# EAGLE board axiom_beta_interface_dummy_v0.13_r1.3 (EAGLE 7.7.0), part 1 of 2
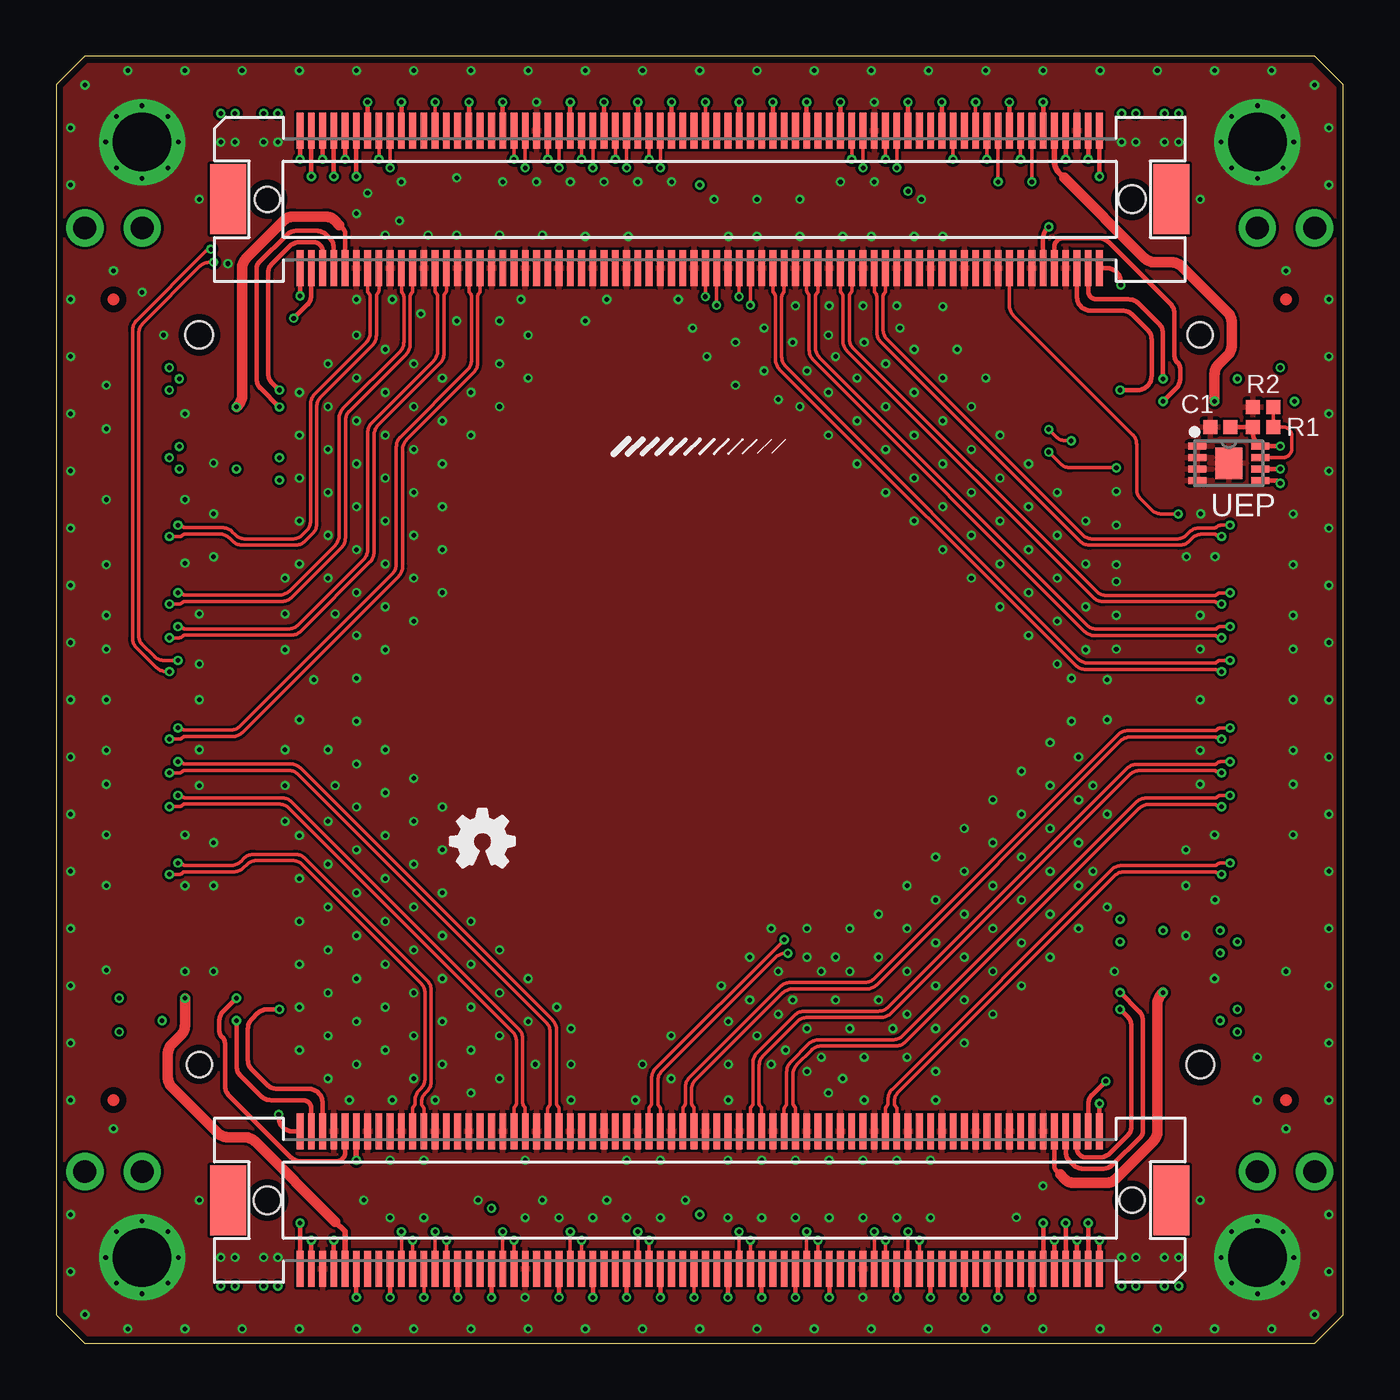
[diagram p3: board, top side]
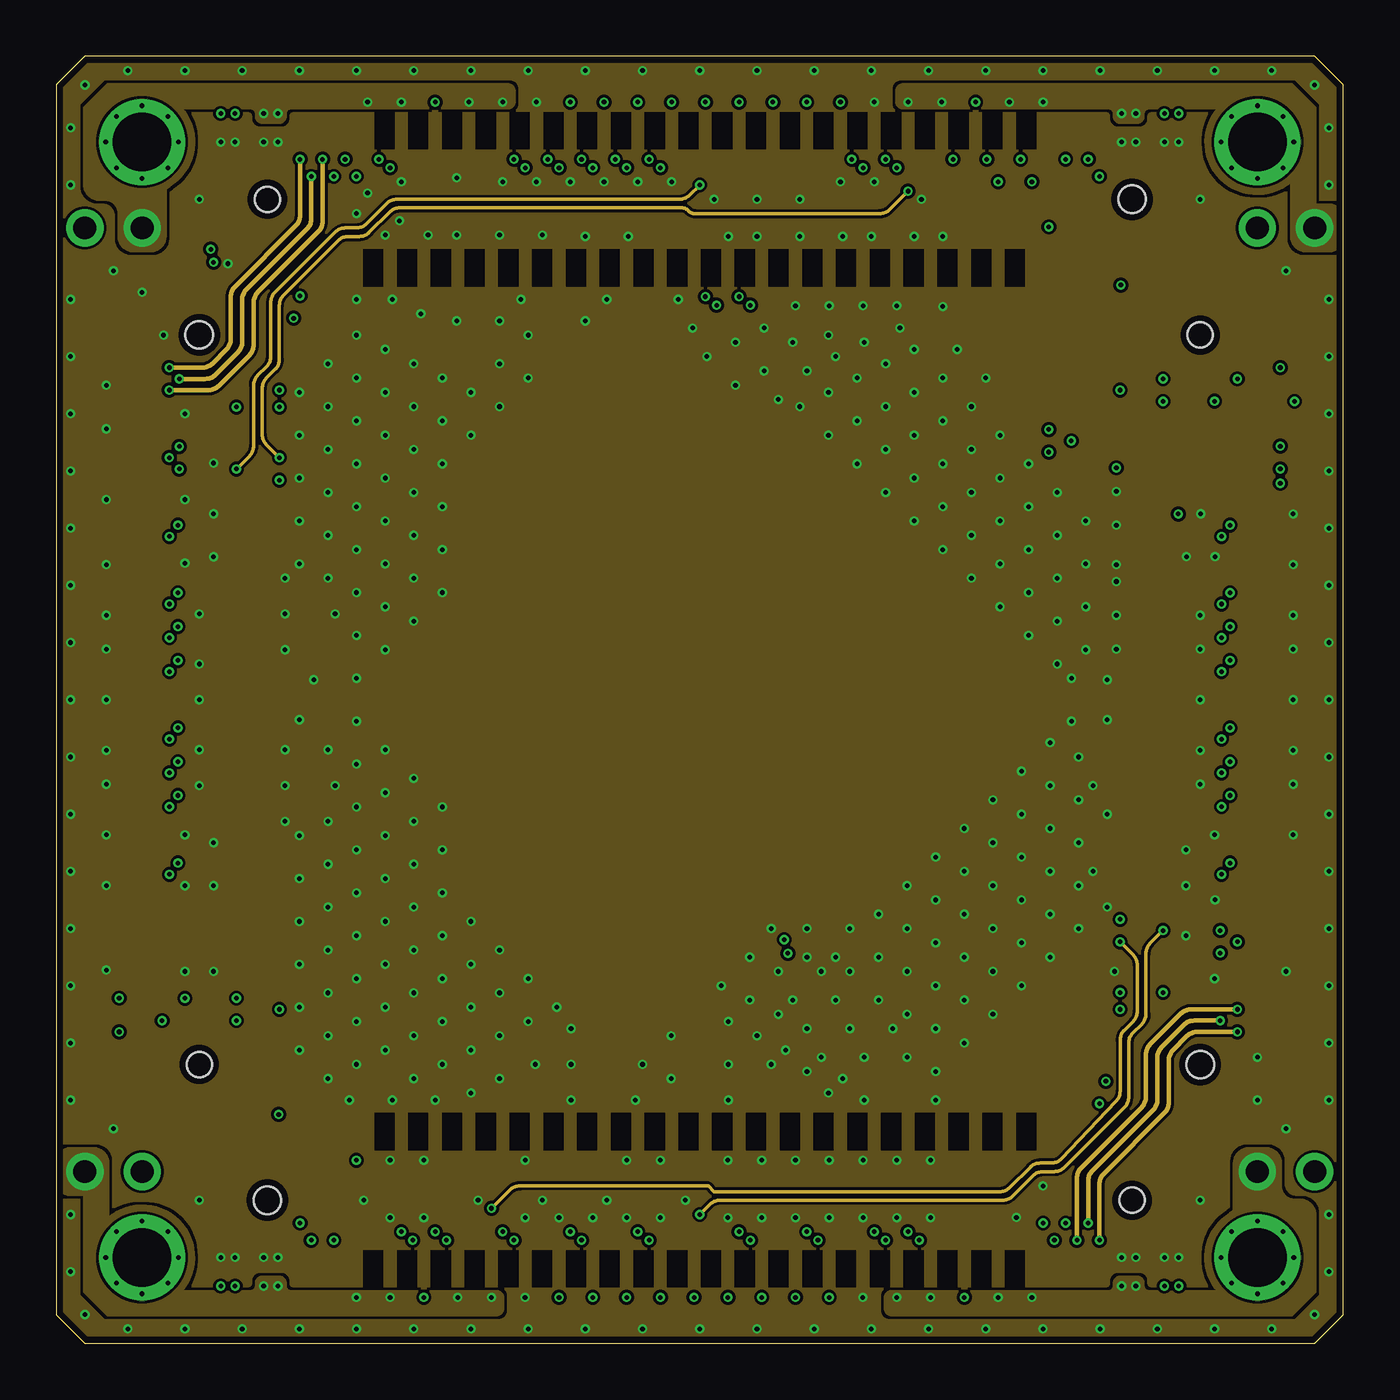
[diagram p4: board, inner layer Route2]
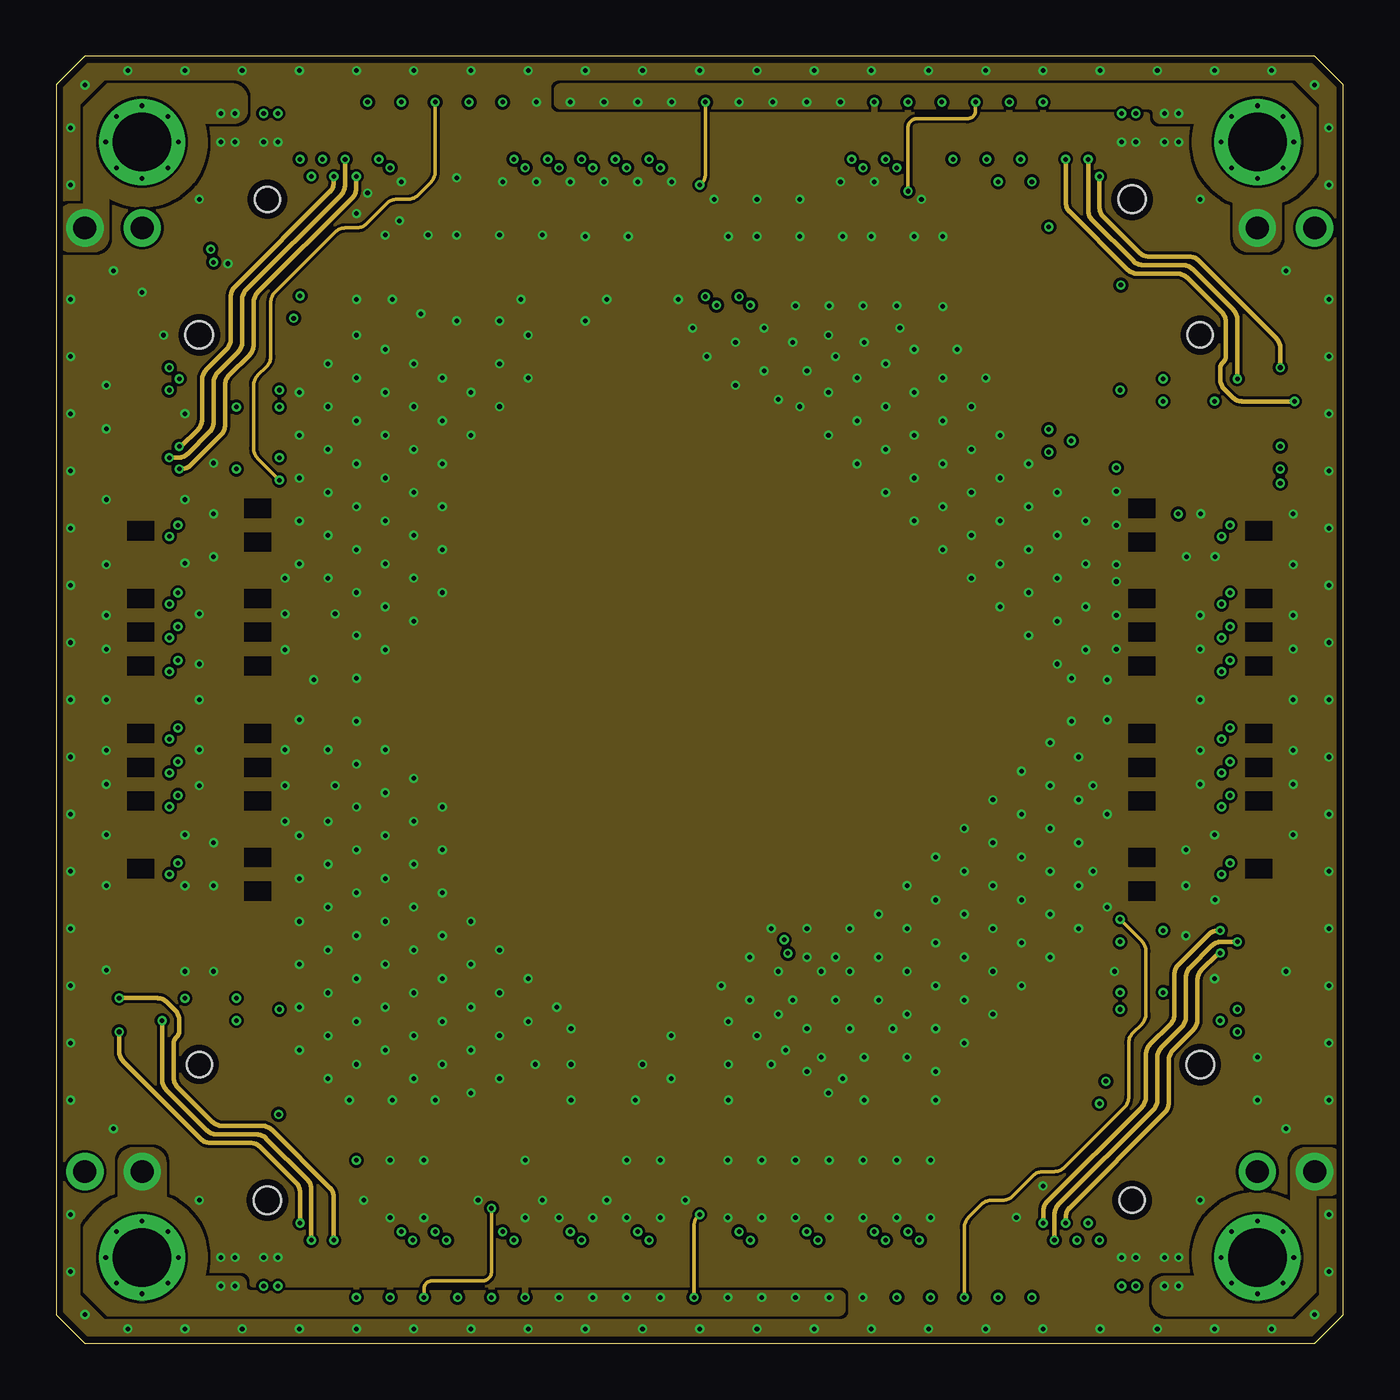
[diagram p5: board, inner layer Route15]
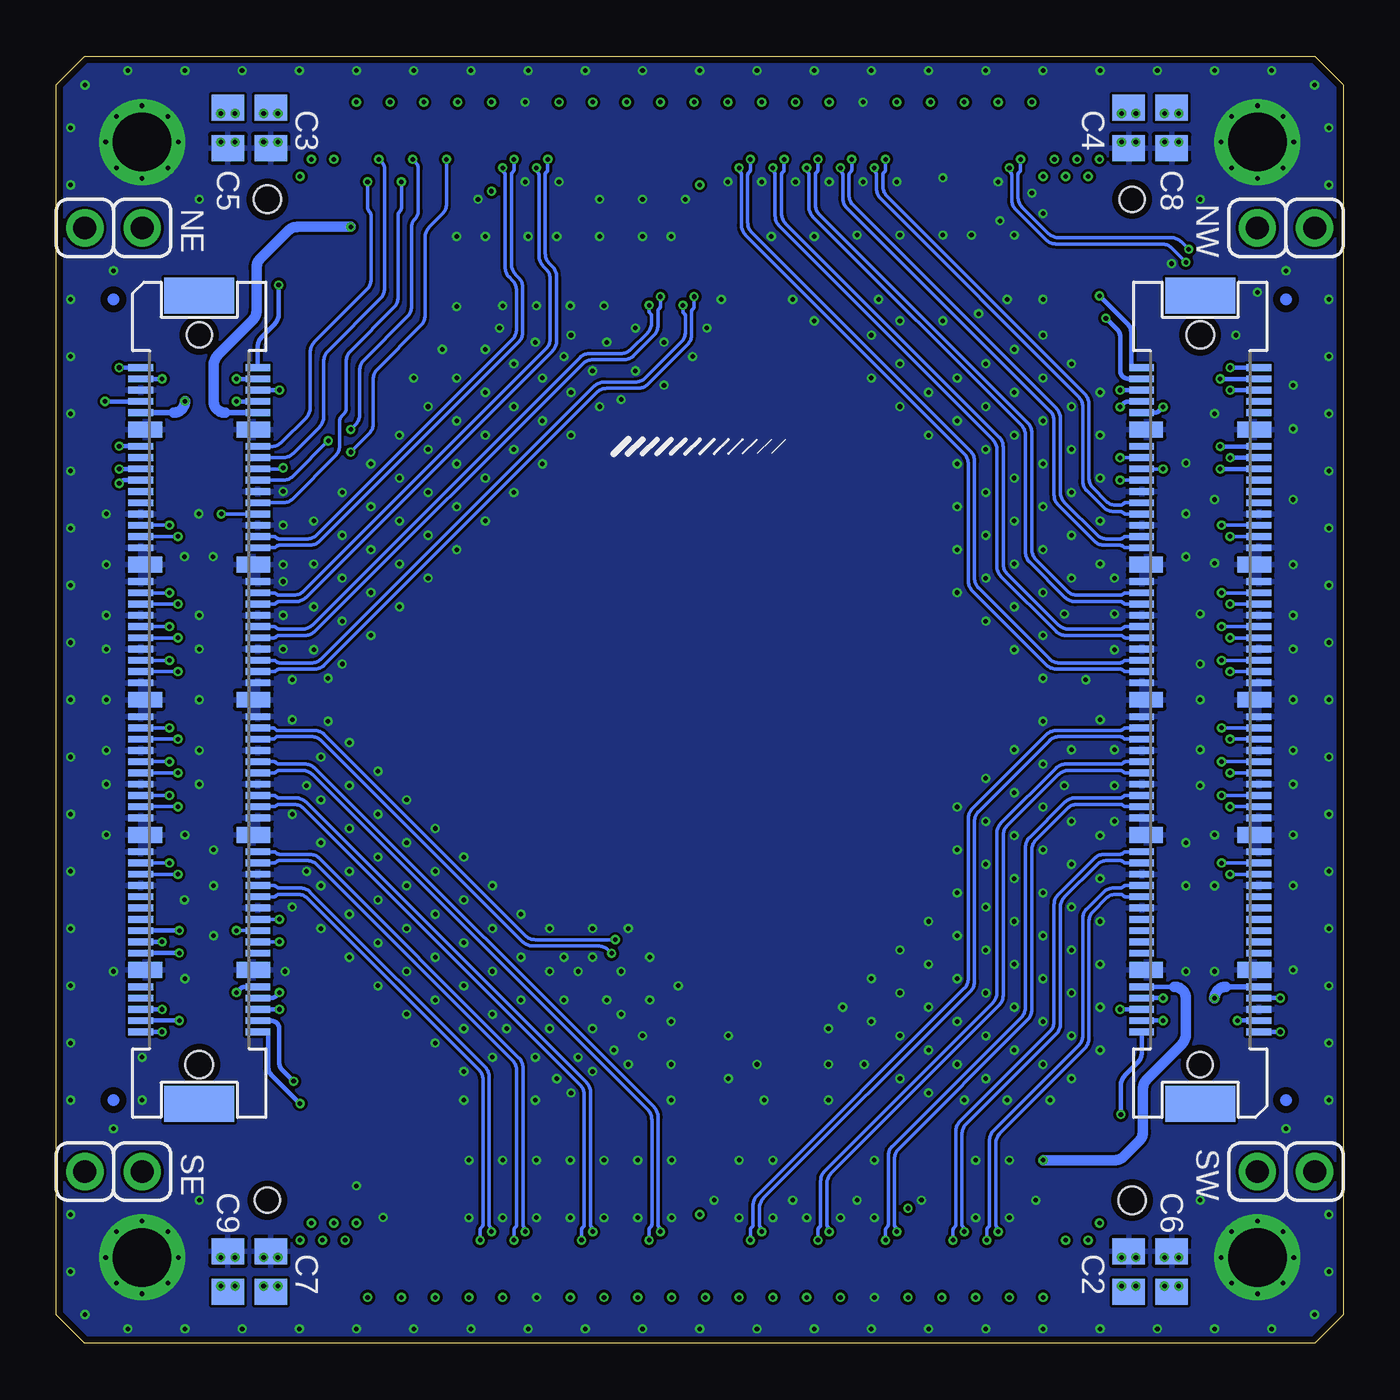
[diagram p6: board, bottom side, seen from below]

Size 57.15 x 57.15 mm. Coordinates in mm from the lower left corner, seen from the top.
Outline: 0,55.88 0,1.27 1.27,0 55.88,0 57.15,1.27 57.15,55.88 55.88,57.15 1.27,57.15 0,55.88
Copper layers (1*2*15*16): Top 0.035559375mm / dielectric 0.17018125mm / Route2 0.01778125mm / dielectric 47mil / Route15 0.01778125mm / dielectric 0.17018125mm / Bottom 0.035559375mm
Design rules "OSHPark-4layer-tuned *": minimum track width 5mil, minimum drill 8mil, track to track 5mil, track to pad 5mil, pad to pad 5mil, via to via 5mil, smd to smd 5mil, copper to edge 12mil, drill to drill 6mil, minimum pad ring 4mil, minimum via ring 4mil, stop-mask expansion 2mil, vias tented up to drill 15mil, thermal gap 6mil
Net classes: 0 default: width 0.152 mm, drill 0.203 mm; 1 power: width 0.152 mm, drill 0.203 mm
tKeepout: area 1.6,51.1 to 6,55.5; area 51.1,51.1 to 55.5,55.5; area 51.1,1.6 to 55.5,6; area 1.6,1.6 to 6,6
bKeepout: area 1.6,51.1 to 6,55.5; area 51.1,51.1 to 55.5,55.5; area 51.1,1.6 to 55.5,6; area 1.6,1.6 to 6,6

## Footprints (pad centres in the part's own frame; a part is rotated, then mirrored left to right if it is on the bottom)
0402-B = smd 0.62 x 0.62: 1 -0.45,0; 2 0.45,0
0805-B = smd 1.15 x 1.45: 1 -0.9,0; 2 0.9,0
1X02 = drill 1.016 pad 1.651: 1 -1.27,0; 2 1.27,0
DFN200X300X100-9N = smd 0.813 x 0.305: 1 -1.397,0.762; 2 -1.397,0.254; 3 -1.397,-0.254; 4 -1.397,-0.762; 5 1.397,-0.762; 6 1.397,-0.254; 7 1.397,0.254; 8 1.397,0.762 | smd 1.194 x 1.397: EP 0,0
FX10A-100P/10 = smd 0.3 x 1.1: 1 -14.75,-2.6; 2 -14.75,2.6; 3 -14.25,-2.6; 4 -14.25,2.6; 5 -13.75,-2.6; 6 -13.75,2.6; 7 -13.25,-2.6; 8 -13.25,2.6; 9 -12.75,-2.6; 10 -12.75,2.6; 11 -11.25,-2.6; 12 -11.25,2.6; 13 -10.75,-2.6; 14 -10.75,2.6; 15 -10.25,-2.6; 16 -10.25,2.6; 17 -9.75,-2.6; 18 -9.75,2.6; 19 -9.25,-2.6; 20 -9.25,2.6; 21 -8.75,-2.6; 22 -8.75,2.6; 23 -8.25,-2.6; 24 -8.25,2.6; 25 -7.75,-2.6; 26 -7.75,2.6; 27 -7.25,-2.6; 28 -7.25,2.6; 29 -6.75,-2.6; 30 -6.75,2.6; 31 -5.25,-2.6; 32 -5.25,2.6; 33 -4.75,-2.6; 34 -4.75,2.6; 35 -4.25,-2.6; 36 -4.25,2.6; 37 -3.75,-2.6; 38 -3.75,2.6; 39 -3.25,-2.6; 40 -3.25,2.6; 41 -2.75,-2.6; 42 -2.75,2.6; 43 -2.25,-2.6; 44 -2.25,2.6; 45 -1.75,-2.6; 46 -1.75,2.6; 47 -1.25,-2.6; 48 -1.25,2.6; 49 -0.75,-2.6; 50 -0.75,2.6; 51 0.75,-2.6; 52 0.75,2.6; 53 1.25,-2.6; 54 1.25,2.6; 55 1.75,-2.6; 56 1.75,2.6; 57 2.25,-2.6; 58 2.25,2.6; 59 2.75,-2.6; 60 2.75,2.6; 61 3.25,-2.6; 62 3.25,2.6; 63 3.75,-2.6; 64 3.75,2.6; 65 4.25,-2.6; 66 4.25,2.6; 67 4.75,-2.6; 68 4.75,2.6; 69 5.25,-2.6; 70 5.25,2.6; 71 6.75,-2.6; 72 6.75,2.6; 73 7.25,-2.6; 74 7.25,2.6; 75 7.75,-2.6; 76 7.75,2.6; 77 8.25,-2.6; 78 8.25,2.6; 79 8.75,-2.6; 80 8.75,2.6; 81 9.25,-2.6; 82 9.25,2.6; 83 9.75,-2.6; 84 9.75,2.6; 85 10.25,-2.6; 86 10.25,2.6; 87 10.75,-2.6; 88 10.75,2.6; 89 11.25,-2.6; 90 11.25,2.6; 91 12.75,-2.6; 92 12.75,2.6; 93 13.25,-2.6; 94 13.25,2.6; 95 13.75,-2.6; 96 13.75,2.6; 97 14.25,-2.6; 98 14.25,2.6; 99 14.75,-2.6; 100 14.75,2.6 | smd 0.7 x 1.5: G1 -12,-2.4; G2 -12,2.4; G3 -6,-2.4; G4 -6,2.4; G5 0,-2.4; G6 0,2.4; G7 6,-2.4; G8 6,2.4; G9 12,-2.4; G10 12,2.4 | smd 1.6 x 3.1: M1 -17.95,0; M2 17.95,0 | hole 1.125: -16.2,0 | hole 1.225: 16.2,0
FX10A-144S = smd 0.3 x 1.6: 1 -17.75,3.05; 2 -17.75,-3.05; 3 -17.25,3.05; 4 -17.25,-3.05; 5 -16.75,3.05; 6 -16.75,-3.05; 7 -16.25,3.05; 8 -16.25,-3.05; 9 -15.75,3.05; 10 -15.75,-3.05; 11 -15.25,3.05; 12 -15.25,-3.05; 13 -14.75,3.05; 14 -14.75,-3.05; 15 -14.25,3.05; 16 -14.25,-3.05; 17 -13.75,3.05; 18 -13.75,-3.05; 19 -13.25,3.05; 20 -13.25,-3.05; 21 -12.75,3.05; 22 -12.75,-3.05; 23 -12.25,3.05; 24 -12.25,-3.05; 25 -11.75,3.05; 26 -11.75,-3.05; 27 -11.25,3.05; 28 -11.25,-3.05; 29 -10.75,3.05; 30 -10.75,-3.05; 31 -10.25,3.05; 32 -10.25,-3.05; 33 -9.75,3.05; 34 -9.75,-3.05; 35 -9.25,3.05; 36 -9.25,-3.05; 37 -8.75,3.05; 38 -8.75,-3.05; 39 -8.25,3.05; 40 -8.25,-3.05; 41 -7.75,3.05; 42 -7.75,-3.05; 43 -7.25,3.05; 44 -7.25,-3.05; 45 -6.75,3.05; 46 -6.75,-3.05; 47 -6.25,3.05; 48 -6.25,-3.05; 49 -5.75,3.05; 50 -5.75,-3.05; 51 -5.25,3.05; 52 -5.25,-3.05; 53 -4.75,3.05; 54 -4.75,-3.05; 55 -4.25,3.05; 56 -4.25,-3.05; 57 -3.75,3.05; 58 -3.75,-3.05; 59 -3.25,3.05; 60 -3.25,-3.05; 61 -2.75,3.05; 62 -2.75,-3.05; 63 -2.25,3.05; 64 -2.25,-3.05; 65 -1.75,3.05; 66 -1.75,-3.05; 67 -1.25,3.05; 68 -1.25,-3.05; 69 -0.75,3.05; 70 -0.75,-3.05; 71 -0.25,3.05; 72 -0.25,-3.05; 73 0.25,3.05; 74 0.25,-3.05; 75 0.75,3.05; 76 0.75,-3.05; 77 1.25,3.05; 78 1.25,-3.05; 79 1.75,3.05; 80 1.75,-3.05; 81 2.25,3.05; 82 2.25,-3.05; 83 2.75,3.05; 84 2.75,-3.05; 85 3.25,3.05; 86 3.25,-3.05; 87 3.75,3.05; 88 3.75,-3.05; 89 4.25,3.05; 90 4.25,-3.05; 91 4.75,3.05; 92 4.75,-3.05; 93 5.25,3.05; 94 5.25,-3.05; 95 5.75,3.05; 96 5.75,-3.05; 97 6.25,3.05; 98 6.25,-3.05; 99 6.75,3.05; 100 6.75,-3.05; 101 7.25,3.05; 102 7.25,-3.05; 103 7.75,3.05; 104 7.75,-3.05; 105 8.25,3.05; 106 8.25,-3.05; 107 8.75,3.05; 108 8.75,-3.05; 109 9.25,3.05; 110 9.25,-3.05; 111 9.75,3.05; 112 9.75,-3.05; 113 10.25,3.05; 114 10.25,-3.05; 115 10.75,3.05; 116 10.75,-3.05; 117 11.25,3.05; 118 11.25,-3.05; 119 11.75,3.05; 120 11.75,-3.05; 121 12.25,3.05; 122 12.25,-3.05; 123 12.75,3.05; 124 12.75,-3.05; 125 13.25,3.05; 126 13.25,-3.05; 127 13.75,3.05; 128 13.75,-3.05; 129 14.25,3.05; 130 14.25,-3.05; 131 14.75,3.05; 132 14.75,-3.05; 133 15.25,3.05; 134 15.25,-3.05; 135 15.75,3.05; 136 15.75,-3.05; 137 16.25,3.05; 138 16.25,-3.05; 139 16.75,3.05; 140 16.75,-3.05; 141 17.25,3.05; 142 17.25,-3.05; 143 17.75,3.05; 144 17.75,-3.05 | smd 1.6 x 3.1: M1 -20.95,0; M2 20.95,0 | hole 1.125: -19.2,0 | hole 1.225: 19.2,0

## Placement (x,y rotation side)
C1  100n  [0402-B]  51.69,40.69 180 top
C2  47u  [0805-B]  9.52,3.18 90 bottom
C3  47u  [0805-B]  49.53,53.97 270 bottom
C4  47u  [0805-B]  9.52,53.97 270 bottom
C5  47u  [0805-B]  47.62,53.97 270 bottom
C6  47u  [0805-B]  7.62,3.18 90 bottom
C7  47u  [0805-B]  47.62,3.18 90 bottom
C8  47u  [0805-B]  7.62,53.97 270 bottom
C9  47u  [0805-B]  49.53,3.18 90 bottom
FID1  FIDUCIAL  [FID_ARROW]  2.54,46.36 0 top
FID2  FIDUCIAL  [FID_ARROW]  54.61,46.36 0 top
FID3  FIDUCIAL  [FID_ARROW]  54.61,10.79 0 top
FID4  FIDUCIAL  [FID_ARROW]  2.54,10.79 0 top
FID5  FIDUCIAL-3A  [FID_3ARROW]  2.54,46.36 180 bottom
FID6  FIDUCIAL-3A  [FID_3ARROW]  54.61,46.36 0 bottom
FID7  FIDUCIAL-3A  [FID_3ARROW]  54.61,10.79 0 bottom
FID8  FIDUCIAL-3A  [FID_3ARROW]  2.54,10.79 180 bottom
LOGO1  OSHW_LOGO_FILLX0100-NT  [OSHW_FILLX100_NOTEXT]  17.5,21.16 0 top
NE  [1X02]  54.61,49.53 180 bottom
NW  [1X02]  2.54,49.53 0 bottom
PARALLELLA  [PARALLELLA-FRAME]  28.57,28.57 0 top
R1  10k  [0402-B]  53.59,40.69 0 top
R2  1k  [0402-B]  53.59,41.58 180 top
SE  [1X02]  54.61,7.62 180 bottom
SW  [1X02]  2.54,7.62 0 bottom
U$1  [µZ-FRAME]  28.57,28.57 0 top
U$2  APERTUS_LOGO334X100  [APERTUS_LOGO_334X100]  19.5,30.29 0 top
U$3  AXIOM_LOGO525X80  [AXIOM_LOGO_525X80]  22.02,28.09 0 top
UEP  BR24G04NUX  [DFN200X300X100-9N]  52.07,39.08 0 top
X-EAST  FX10-100/10P  [FX10A-100P/10]  50.8,28.57 270 bottom
X-NORTH  FX10-144S  [FX10A-144S]  28.57,50.8 0 top
X-SOUTH  FX10-144S  [FX10A-144S]  28.57,6.35 180 top
X-WEST  FX10-100/10P  [FX10A-100P/10]  6.35,28.57 90 bottom

## Tracks (layer width: path | path; a pad name or v marks a point on that pad's centre or on a via)
CLK_IN  (via drill 0.2)
  Top 0.152: X-NORTH.128 42.33,46.09 arc45 42.51,45.64 47.79,40.36 arc-45 47.97,39.91 47.97,37.94 arc45 48.16,37.49 48.64,37.01 arc45 49.09,36.83 v49.83,36.83
  Bottom 0.152: X-EAST.24 v49.83,36.83
E_I2C_V  (via drill 0.2)
  Top 0.203: v54.36,39.84 UEP.8 53.33,39.97 arc-45 53.14,40.42 R1.1 C1.1
  Bottom 0.152: X-EAST.11 arc-45 53.43,39.84
  Bottom 0.203: 53.43,39.84 v54.36,39.84
E_SCL  (via drill 0.2)
  Top 0.203: UEP.6 v54.36,38.82
  Bottom 0.203: v54.36,38.82 v54.35,38.83 X-EAST.15
E_SDA  (via drill 0.2)
  Top 0.203: 54.25,38.29 v54.36,38.19 54.23,38.31 UEP.5
  Bottom 0.203: v54.36,38.19 54.29,38.25 arc45 54.11,38.33 X-EAST.17
E_VE  (via drill 0.2)
  Bottom 0.152: v49.85,2.54 49.8,2.54 C9.1
  other vias: 49.21,2.54
  pour Route15 (no thermals): 50.64,2.92 arc-141 54.86,6.21 54.86,8 arc-90 55.5,8.64 56.52,8.64 arc-90 57.15,8 57.15,7.24 arc-90 56.52,6.6 55.88,6.6 55.88,2.29 54.86,1.27 49.35,1.27 arc-90 48.72,1.9 48.72,2.43 arc-90 49.23,2.92
FRAME_REQ  (via drill 0.2)
  Top 0.152: X-NORTH.129 v42.83,52.58
  Bottom 0.152: v42.83,52.58 42.69,52.44 arc45 42.58,52.17 42.58,46.84 arc45 42.76,46.39 45.09,44.06 arc-45 45.27,43.61 45.27,41.14 arc45 45.46,40.69 46.64,39.51 arc45 47.09,39.33 X-EAST.14
GND  (via drill 0.2, 0.2 pad 0.25, 2.6 pad 3.81)
  other vias: 1.27,1.27 0.63,3.18 0.63,5.71 0.63,10.79 0.63,13.33 0.63,15.88 0.63,18.41 0.63,20.95 0.63,23.49 0.63,26.04 0.63,28.57 0.63,31.11 0.63,33.66 0.63,36.2 0.63,38.73 0.63,41.27 0.63,43.81 0.63,46.36 0.63,51.44 0.63,53.97 1.27,55.88 56.52,3.18 56.52,5.71 56.52,10.79 56.52,13.33 56.52,15.88 56.52,18.41 56.52,20.95 56.52,23.49 56.52,26.04 56.52,28.57 56.52,31.11 56.52,33.66 56.52,36.2 56.52,38.73 56.52,41.27 56.52,43.81 56.52,46.36 56.52,51.44 56.52,53.97 55.88,55.88 53.97,56.52 51.44,56.52 48.89,56.52 46.36,56.52 43.81,56.52 41.27,56.52 38.73,56.52 36.2,56.52 33.66,56.52 31.11,56.52 28.57,56.52 26.04,56.52 23.49,56.52 20.95,56.52 18.41,56.52 15.88,56.52 13.33,56.52 10.79,56.52 8.25,56.52 5.71,56.52 3.18,56.52 53.97,0.63 51.44,0.63 48.89,0.63 46.36,0.63 43.81,0.63 41.27,0.63 38.73,0.63 36.2,0.63 33.66,0.63 31.11,0.63 28.57,0.63 26.04,0.63 23.49,0.63 20.95,0.63 18.41,0.63 15.88,0.63 13.33,0.63 10.79,0.63 8.25,0.63 5.71,0.63 3.18,0.63 55.88,1.27 21.32,55.12 36.33,55.12 20.82,2.03 35.82,2.03 47.08,32.33 47.08,33.83 47.08,30.82 47.08,34.58 47.08,36.33 47.08,37.83 35.83,46.08 37.33,46.08 34.33,46.08 32.83,46.08 25.82,51.58 27.32,51.58 24.32,51.58 22.82,51.58 21.32,51.58 19.82,51.58 34.83,51.58 36.33,51.58 23.82,5.57 26.82,5.57 20.82,5.57 22.32,5.57 25.32,5.57 16.32,5.57 14.82,5.57 29.82,5.57 31.32,5.57 32.83,5.57 34.33,5.57 35.83,5.57 37.33,5.57 38.83,5.57 15.32,51.58 13.82,51.08 12.06,15.56 10.79,13.02 13.33,12.38 14.92,10.79 16.83,10.79 15.88,11.75 14.6,13.02 13.33,14.29 12.06,13.65 15.88,13.65 14.6,14.92 15.88,15.56 17.14,16.19 18.41,16.83 19.68,15.56 20.95,14.29 18.41,14.92 17.14,14.29 19.68,13.65 18.41,13.02 17.14,12.38 18.41,11.11 19.68,11.75 21.27,12.38 22.86,12.38 22.86,10.79 22.86,13.97 22.23,14.92 20.95,16.19 19.68,17.46 18.41,18.73 17.14,20 17.14,18.1 15.88,17.46 14.6,16.83 13.33,16.19 10.79,14.92 10.79,16.83 12.06,17.46 13.33,18.1 14.6,18.73 15.88,19.37 15.88,21.27 14.6,20.64 13.33,20 13.33,21.91 14.6,22.54 15.88,23.18 17.14,21.91 17.14,23.81 12.06,21.27 10.79,20.64 12.06,19.37 10.79,18.73 10.79,22.54 12.06,23.18 13.33,23.81 14.6,24.45 15.88,25.08 14.6,26.35 13.33,27.62 10.79,27.69 13.33,25.72 10.16,24.77 10.16,26.35 10.16,23.18 12.06,26.35 12.38,24.77 5.71,20.32 6.98,20.32 6.98,22.23 5.71,22.57 13.33,29.53 11.43,29.46 14.6,30.8 15.88,32.07 17.14,33.34 17.14,35.24 17.14,37.15 17.14,39.05 13.33,31.43 14.6,32.7 15.88,33.97 15.88,35.88 14.6,34.61 13.33,35.24 12.06,35.88 10.79,36.51 14.6,36.51 13.33,37.15 12.06,37.78 10.79,38.42 12.06,39.69 13.33,39.05 14.6,38.42 15.88,37.78 15.88,39.69 14.6,40.32 13.33,40.96 12.06,41.59 10.79,42.23 10.79,40.32 10.16,30.8 10.16,32.38 10.16,33.97 13.33,33.34 12.06,33.97 10.79,34.61 12.38,32.38 18.41,40.32 17.14,40.96 15.88,41.59 14.6,42.23 13.33,42.86 12.06,43.5 13.33,44.77 14.6,44.13 15.88,43.5 17.14,42.86 18.41,42.23 19.68,41.59 20.95,42.86 23.49,45.4 19.68,43.5 20.95,44.77 19.68,45.4 17.78,45.4 16.19,45.72 14.92,46.36 13.33,46.36 20.64,46.36 25.72,10.79 29.84,14.29 31.11,13.65 32.38,13.02 34.92,11.75 34.29,11.11 31.75,12.38 29.84,12.38 33.34,13.97 35.24,13.97 37.15,13.97 35.88,12.7 33.97,12.7 33.34,12.06 35.88,10.79 37.78,12.7 39.05,13.97 37.78,14.6 36.51,15.24 33.97,16.51 34.61,15.24 32.7,15.24 32.07,16.51 30.8,15.24 32.07,14.6 29.53,15.88 30.8,17.14 27.3,13.65 27.3,11.75 29.84,10.79 39.05,12.06 40.32,13.33 40.32,15.24 41.59,14.6 42.86,15.88 44.13,17.14 45.4,18.41 41.59,16.51 42.86,17.78 44.13,19.05 39.05,15.88 37.78,16.51 36.51,17.14 35.24,16.51 40.32,17.14 39.05,17.78 37.78,18.41 36.51,19.05 37.78,20.32 39.05,19.68 40.32,19.05 41.59,18.41 42.86,19.68 41.59,20.32 40.32,20.95 39.05,21.59 45.4,20.32 44.13,20.95 42.86,21.59 41.59,22.23 40.32,22.86 45.4,22.23 44.13,22.86 42.86,23.49 41.59,24.13 42.86,25.4 44.13,24.77 45.4,24.13 46.67,23.49 46.04,24.77 45.4,26.04 44.13,26.67 45.09,27.62 45.09,29.53 46.67,27.69 46.67,29.46 45.72,30.8 45.72,32.7 45.72,34.61 44.45,32.07 43.18,33.34 41.91,34.61 43.18,31.43 41.91,32.7 44.45,30.16 40.64,33.97 40.64,35.88 39.37,35.24 39.37,37.15 38.1,36.51 38.1,38.42 36.83,37.78 36.83,39.69 35.56,39.05 35.56,40.96 34.29,40.32 34.29,42.23 33.02,41.59 33.34,43.18 32.07,41.91 30.16,42.55 28.89,43.81 31.43,43.18 30.16,44.45 31.43,45.09 32.7,44.45 34.61,43.81 35.56,42.86 36.83,43.5 38.1,44.13 35.88,44.45 37.47,45.09 34.29,44.77 36.83,41.59 38.1,40.32 39.37,39.05 40.64,37.78 41.91,36.51 43.18,35.24 44.45,33.97 44.45,35.88 45.72,36.51 43.18,37.15 44.45,37.78 41.91,38.42 43.18,39.05 41.91,40.32 40.64,39.69 40.64,41.59 39.37,40.96 38.1,42.23 39.37,42.86 50.82,36.83 50.19,34.93 46.67,19.37 46.04,20.95 39.05,10.79 26.04,12.38 33.34,18.41 35.24,18.41 34.61,17.14 28.26,45.09 21.59,49.21 23.49,49.15 25.4,49.15 13.33,50.16 15.24,49.85 7.62,47.94 2.54,47.62 6.35,50.8 3.81,46.67 50.16,20.32 50.16,21.91 5.71,34.64 6.98,34.92 6.98,36.83 5.71,37.47 51.46,34.93 51.46,19.69 51.44,22.57 51.44,16.19 50.16,18.1 5.71,16.51 6.98,16.51 5.71,41.27 6.98,39.09 24.45,46.36 27.62,46.36 31.75,18.41 12.06,11.75 13.02,10.79 14.82,8.13 16.32,8.13 31.32,8.13 32.83,8.13 34.33,8.13 35.83,8.13 37.33,8.13 38.83,8.13 29.82,8.13 20.82,8.13 25.32,8.13 26.82,8.13 29.84,49.15 31.11,49.15 17.78,49.21 14.6,49.21 16.51,49.21 33.02,49.15 36.2,49.15 34.92,49.15 38.1,49.15 39.37,49.15 39.37,46.04 40,44.13 41.27,42.86 42.63,5.59 43.81,6.98 54.61,47.62 50.8,50.8 6.35,6.35 50.8,6.35 2.54,9.52 54.61,9.52 7.3,3.81 7.94,3.81 9.21,3.81 9.84,3.81 47.31,3.81 47.94,3.81 49.21,3.81 49.85,3.81 49.85,53.34 49.21,53.34 47.94,53.34 47.31,53.34 9.84,53.34 9.21,53.34 7.94,53.34 7.3,53.34 2.22,34.58 2.22,32.33 2.22,30.82 2.22,28.57 2.22,26.32 2.22,24.82 2.22,22.57 2.22,20.32 2.22,16.57 54.93,36.83 54.93,34.58 54.93,32.33 54.93,30.82 54.93,28.57 54.93,26.32 54.93,24.82 54.93,22.57 53.34,10.79 53.34,12.7 46.99,16.51 54.61,16.51 17.78,51.75 29.21,50.8 33.02,50.8 27.94,6.35 18.73,6.35 13.65,6.35 31.11,50.8 6.35,28.57 6.35,30.16 6.35,24.77 6.35,26.35 6.35,32.38 50.8,24.82 50.8,26.32 50.8,28.57 50.8,30.82 50.8,32.33 33.34,17.14 19.68,49.21 38.42,50.8 21.59,6.35 24.45,6.35 2.22,40.61 2.22,37.47 2.22,42.55 4.76,44.77 3.81,3.81 4.95,4.95 4.95,2.67 2.67,2.67 2.67,4.95 53.34,3.81 53.34,5.43 54.96,3.81 53.34,2.19 51.72,3.81 54.48,4.95 54.48,2.67 52.2,2.67 52.2,4.95 3.81,53.34 3.81,54.96 5.43,53.34 3.81,51.72 2.19,53.34 4.95,54.48 4.95,52.2 2.67,52.2 2.67,54.48 53.34,53.34 53.34,54.96 54.96,53.34 53.34,51.72 51.72,53.34 54.48,54.48 54.48,52.2 52.2,52.2 52.2,54.48 3.81,5.43 5.43,3.81 3.81,2.19 2.19,3.81
  pour Top (rank 3): 0,1.27 0,55.88 1.27,57.15 55.88,57.15 57.15,55.88 57.15,1.27 55.88,0 1.27,0
  pour Route2 (rank 3): 0,1.27 0,55.88 1.27,57.15 55.88,57.15 57.15,55.88 57.15,1.27 55.88,0 1.27,0
  pour Route15 (rank 3): 0,1.27 0,55.88 1.27,57.15 55.88,57.15 57.15,55.88 57.15,1.27 55.88,0 1.27,0
  pour Bottom (rank 3): 0,1.27 0,55.88 1.27,57.15 55.88,57.15 57.15,55.88 57.15,1.27 55.88,0 1.27,0
LVDS_CLK_N  (via drill 0.2)
  Top 0.152: X-NORTH.14 13.82,46.74 arc45 13.86,46.65 arc-45 13.93,46.47 13.93,44.88 arc-45 13.75,44.43 11.48,42.15 arc45 11.29,41.7 11.29,36.52 arc-45 11.1,36.07 10.94,35.9 arc-45 10.49,35.71 8.4,35.71 arc-45 7.95,35.9 7.82,36.03 arc45 7.37,36.21 5.73,36.21 arc-45 5.62,36.26 5.56,36.33 v5.4,36.33
  Bottom 0.152: v5.4,36.33 X-WEST.75
LVDS_CLK_P  (via drill 0.2)
  Top 0.152: X-NORTH.16 14.32,46.74 arc-45 14.29,46.65 arc45 14.21,46.47 14.21,44.76 arc-45 14.03,44.31 11.76,42.04 arc45 11.57,41.59 11.57,36.4 arc-45 11.38,35.95 11.05,35.62 arc-45 10.61,35.44 8.28,35.44 arc-45 7.83,35.62 7.7,35.75 arc45 7.25,35.94 5.75,35.94 arc45 5.57,35.86 arc-45 5.48,35.83 v5.02,35.83
  Bottom 0.152: v5.02,35.83 X-WEST.73
N$1
  cutout Route15: 52.83,36.5 53.97,36.5 53.97,35.65 52.83,35.65
  cutout Route15: 52.83,33.5 53.97,33.5 53.97,32.65 52.83,32.65
  cutout Route15: 52.83,32 53.97,32 53.97,31.15 52.83,31.15
  cutout Route15: 52.83,30.5 53.97,30.5 53.97,29.65 52.83,29.65
  cutout Route15: 52.83,27.5 53.97,27.5 53.97,26.65 52.83,26.65
  cutout Route15: 52.83,26 53.97,26 53.97,25.15 52.83,25.15
  cutout Route15: 52.83,24.5 53.97,24.5 53.97,23.65 52.83,23.65
  cutout Route15: 52.83,21.5 53.97,21.5 53.97,20.65 52.83,20.65
  cutout Route15: 47.62,22 48.77,22 48.77,21.15 47.62,21.15
  cutout Route15: 47.62,20.5 48.77,20.5 48.77,19.65 47.62,19.65
  cutout Route15: 47.62,24.5 48.77,24.5 48.77,23.65 47.62,23.65
  cutout Route15: 47.62,26 48.77,26 48.77,25.15 47.62,25.15
  cutout Route15: 47.62,27.5 48.77,27.5 48.77,26.65 47.62,26.65
  cutout Route15: 47.62,30.5 48.77,30.5 48.77,29.65 47.62,29.65
  cutout Route15: 47.62,32 48.77,32 48.77,31.15 47.62,31.15
  cutout Route15: 47.62,33.5 48.77,33.5 48.77,32.65 47.62,32.65
  cutout Route15: 47.62,36 48.77,36 48.77,35.15 47.62,35.15
  cutout Route15: 47.62,37.5 48.77,37.5 48.77,36.65 47.62,36.65
  cutout Route15: 9.52,29.65 8.38,29.65 8.38,30.5 9.52,30.5
  cutout Route15: 9.52,31.15 8.38,31.15 8.38,32 9.52,32
  cutout Route15: 9.52,32.65 8.38,32.65 8.38,33.5 9.52,33.5
  cutout Route15: 9.52,35.15 8.38,35.15 8.38,36 9.52,36
  cutout Route15: 9.52,36.65 8.38,36.65 8.38,37.5 9.52,37.5
  cutout Route15: 9.52,26.65 8.38,26.65 8.38,27.5 9.52,27.5
  cutout Route15: 9.52,25.15 8.38,25.15 8.38,26 9.52,26
  cutout Route15: 9.52,23.65 8.38,23.65 8.38,24.5 9.52,24.5
  cutout Route15: 9.52,21.15 8.38,21.15 8.38,22 9.52,22
  cutout Route15: 9.52,19.65 8.38,19.65 8.38,20.5 9.52,20.5
  cutout Route15: 4.32,20.65 3.18,20.65 3.18,21.5 4.32,21.5
  cutout Route15: 4.32,23.65 3.18,23.65 3.18,24.5 4.32,24.5
  cutout Route15: 4.32,25.15 3.18,25.15 3.18,26 4.32,26
  cutout Route15: 4.32,26.65 3.18,26.65 3.18,27.5 4.32,27.5
  cutout Route15: 4.32,29.65 3.18,29.65 3.18,30.5 4.32,30.5
  cutout Route15: 4.32,31.15 3.18,31.15 3.18,32 4.32,32
  cutout Route15: 4.32,32.65 3.18,32.65 3.18,33.5 4.32,33.5
  cutout Route15: 4.32,35.65 3.18,35.65 3.18,36.5 4.32,36.5
  cutout Route2: 38.15,53.02 38.15,54.67 39,54.67 39,53.02
  cutout Route2: 36.65,53.02 36.65,54.67 37.5,54.67 37.5,53.02
  cutout Route2: 35.15,53.02 35.15,54.67 36,54.67 36,53.02
  cutout Route2: 33.65,53.02 33.65,54.67 34.5,54.67 34.5,53.02
  cutout Route2: 32.15,53.02 32.15,54.67 33,54.67 33,53.02
  cutout Route2: 30.65,53.02 30.65,54.67 31.5,54.67 31.5,53.02
  cutout Route2: 29.15,53.02 29.15,54.67 30,54.67 30,53.02
  cutout Route2: 27.65,53.02 27.65,54.67 28.5,54.67 28.5,53.02
  cutout Route2: 26.15,53.02 26.15,54.67 27,54.67 27,53.02
  cutout Route2: 24.65,53.02 24.65,54.67 25.5,54.67 25.5,53.02
  cutout Route2: 23.15,53.02 23.15,54.67 24,54.67 24,53.02
  cutout Route2: 21.65,53.02 21.65,54.67 22.5,54.67 22.5,53.02
  cutout Route2: 20.15,53.02 20.15,54.67 21,54.67 21,53.02
  cutout Route2: 18.65,53.02 18.65,54.67 19.5,54.67 19.5,53.02
  cutout Route2: 17.15,53.02 17.15,54.67 18,54.67 18,53.02
  cutout Route2: 15.65,53.02 15.65,54.67 16.5,54.67 16.5,53.02
  cutout Route2: 14.15,53.02 14.15,54.67 15,54.67 15,53.02
  cutout Route2: 39.65,53.02 39.65,54.67 40.5,54.67 40.5,53.02
  cutout Route2: 41.15,53.02 41.15,54.67 42,54.67 42,53.02
  cutout Route2: 42.65,53.02 42.65,54.67 43.5,54.67 43.5,53.02
  cutout Route2: 40.65,46.92 40.65,48.58 41.5,48.58 41.5,46.92
  cutout Route2: 42.15,46.92 42.15,48.58 43,48.58 43,46.92
  cutout Route2: 39.15,46.92 39.15,48.58 40,48.58 40,46.92
  cutout Route2: 37.65,46.92 37.65,48.58 38.5,48.58 38.5,46.92
  cutout Route2: 36.15,46.92 36.15,48.58 37,48.58 37,46.92
  cutout Route2: 34.65,46.92 34.65,48.58 35.5,48.58 35.5,46.92
  cutout Route2: 33.15,46.92 33.15,48.58 34,48.58 34,46.92
  cutout Route2: 31.65,46.92 31.65,48.58 32.5,48.58 32.5,46.92
  cutout Route2: 30.15,46.92 30.15,48.58 31,48.58 31,46.92
  cutout Route2: 28.65,46.92 28.65,48.58 29.5,48.58 29.5,46.92
  cutout Route2: 27.15,46.92 27.15,48.58 28,48.58 28,46.92
  cutout Route2: 25.65,46.92 25.65,48.58 26.5,48.58 26.5,46.92
  cutout Route2: 24.15,46.92 24.15,48.58 25,48.58 25,46.92
  cutout Route2: 22.65,46.92 22.65,48.58 23.5,48.58 23.5,46.92
  cutout Route2: 21.15,46.92 21.15,48.58 22,48.58 22,46.92
  cutout Route2: 19.65,46.92 19.65,48.58 20.5,48.58 20.5,46.92
  cutout Route2: 18.15,46.92 18.15,48.58 19,48.58 19,46.92
  cutout Route2: 16.65,46.92 16.65,48.58 17.5,48.58 17.5,46.92
  cutout Route2: 15.15,46.92 15.15,48.58 16,48.58 16,46.92
  cutout Route2: 13.65,46.92 13.65,48.58 14.5,48.58 14.5,46.92
N$4
  cutout Route2: 19,4.12 19,2.47 18.15,2.47 18.15,4.12
  cutout Route2: 20.5,4.12 20.5,2.47 19.65,2.47 19.65,4.12
  cutout Route2: 22,4.12 22,2.47 21.15,2.47 21.15,4.12
  cutout Route2: 23.5,4.12 23.5,2.47 22.65,2.47 22.65,4.12
  cutout Route2: 25,4.12 25,2.47 24.15,2.47 24.15,4.12
  cutout Route2: 26.5,4.12 26.5,2.47 25.65,2.47 25.65,4.12
  cutout Route2: 28,4.12 28,2.47 27.15,2.47 27.15,4.12
  cutout Route2: 29.5,4.12 29.5,2.47 28.65,2.47 28.65,4.12
  cutout Route2: 31,4.12 31,2.47 30.15,2.47 30.15,4.12
  cutout Route2: 32.5,4.12 32.5,2.47 31.65,2.47 31.65,4.12
  cutout Route2: 34,4.12 34,2.47 33.15,2.47 33.15,4.12
  cutout Route2: 35.5,4.12 35.5,2.47 34.65,2.47 34.65,4.12
  cutout Route2: 37,4.12 37,2.47 36.15,2.47 36.15,4.12
  cutout Route2: 38.5,4.12 38.5,2.47 37.65,2.47 37.65,4.12
  cutout Route2: 40,4.12 40,2.47 39.15,2.47 39.15,4.12
  cutout Route2: 41.5,4.12 41.5,2.47 40.65,2.47 40.65,4.12
  cutout Route2: 43,4.12 43,2.47 42.15,2.47 42.15,4.12
  cutout Route2: 17.5,4.12 17.5,2.47 16.65,2.47 16.65,4.12
  cutout Route2: 16,4.12 16,2.47 15.15,2.47 15.15,4.12
  cutout Route2: 14.5,4.12 14.5,2.47 13.65,2.47 13.65,4.12
  cutout Route2: 16.5,10.22 16.5,8.57 15.65,8.57 15.65,10.22
  cutout Route2: 15,10.22 15,8.57 14.15,8.57 14.15,10.22
  cutout Route2: 18,10.22 18,8.57 17.15,8.57 17.15,10.22
  cutout Route2: 19.5,10.22 19.5,8.57 18.65,8.57 18.65,10.22
  cutout Route2: 21,10.22 21,8.57 20.15,8.57 20.15,10.22
  cutout Route2: 22.5,10.22 22.5,8.57 21.65,8.57 21.65,10.22
  cutout Route2: 24,10.22 24,8.57 23.15,8.57 23.15,10.22
  cutout Route2: 25.5,10.22 25.5,8.57 24.65,8.57 24.65,10.22
  cutout Route2: 27,10.22 27,8.57 26.15,8.57 26.15,10.22
  cutout Route2: 28.5,10.22 28.5,8.57 27.65,8.57 27.65,10.22
  cutout Route2: 30,10.22 30,8.57 29.15,8.57 29.15,10.22
  cutout Route2: 31.5,10.22 31.5,8.57 30.65,8.57 30.65,10.22
  cutout Route2: 33,10.22 33,8.57 32.15,8.57 32.15,10.22
  cutout Route2: 34.5,10.22 34.5,8.57 33.65,8.57 33.65,10.22
  cutout Route2: 36,10.22 36,8.57 35.15,8.57 35.15,10.22
  cutout Route2: 37.5,10.22 37.5,8.57 36.65,8.57 36.65,10.22
  cutout Route2: 39,10.22 39,8.57 38.15,8.57 38.15,10.22
  cutout Route2: 40.5,10.22 40.5,8.57 39.65,8.57 39.65,10.22
  cutout Route2: 42,10.22 42,8.57 41.15,8.57 41.15,10.22
  cutout Route2: 43.5,10.22 43.5,8.57 42.65,8.57 42.65,10.22
N$12
  Top 0.152: UEP.7 54.48,39.33 arc90 54.86,39.71 54.86,40.31 arc90 54.48,40.69 R1.2 R2.1
N$13
  cutout Route2: 15,10.22 15,8.57 14.15,8.57 14.15,10.22
N_CHK_EN  (via drill 0.2 pad 0.25)
  Top 0.203: X-NORTH.8 12.32,48.63 arc45 12.14,49.08 12,49.22 arc45 11.55,49.4 10.68,49.4 arc45 10.23,49.22 9.02,48.01 arc45 8.89,47.7 8.89,42.85 arc45 9.08,42.41 v9.91,41.58
  Bottom 0.203: X-WEST.94 9.55,41.83 arc-45 9.73,41.75 v9.91,41.58
N_CHK_V  (via drill 0.2)
  Top 0.203: X-NORTH.10 12.82,49.3 arc45 12.75,49.48 12.57,49.66
  Top 0.457: 12.57,49.66 12.38,49.85 arc45 11.93,50.04 10.55,50.04 arc45 10.1,49.85 8.44,48.19 arc45 8.25,47.74 8.25,42.1 arc-45 8.07,41.65 v8,41.58
  Bottom 0.203: v8,41.58 8.18,41.4 arc45 8.36,41.33 X-WEST.92
N_I2C_EN  (via drill 0.2 pad 0.25)
  Top 0.203: X-NORTH.137 v44.83,52.58
  Route15 0.203: v44.83,52.58 44.83,50.69 arc45 45.01,50.24 47.57,47.68 arc45 48.02,47.5 49.77,47.5 arc-45 50.22,47.31 51.76,45.78 arc-45 51.94,45.33 51.94,43.85 arc-45 51.83,43.58 51.8,43.55 arc45 51.69,43.28 51.69,42.81 arc45 51.88,42.36 52.22,42.01 arc45 52.67,41.83 v54.99,41.83
  Bottom 0.203: X-EAST.7 v54.99,41.83
N_I2C_V  (via drill 0.2)
  Top 0.254: 44.76,51.75 44.51,52 arc-45 44.33,52.45 X-NORTH.135
  Top 0.457: 44.76,51.75 48.32,48.19 arc45 48.77,48.01 49.52,48.01 arc-45 49.97,47.82 52.01,45.78 arc-45 52.2,45.33 52.2,44.32 arc-45 52.01,43.87 51.62,43.48 arc45 51.44,43.03 v51.44,41.83
  Bottom 0.254: 51.94,41.33 X-EAST.9
  Bottom 0.457: 51.94,41.33 arc-90 v51.44,41.83
N_SCK  (via drill 0.2)
  Top 0.203: X-NORTH.144 46.64,47.75 arc-90 47.27,47.11 v47.27,46.99
  Bottom 0.203: X-EAST.2 48.2,44.25 arc45 48.01,44.7 47.46,45.25 arc-45 47.27,45.7 v47.27,46.99
N_SCL  (via drill 0.2)
  Top 0.203: X-NORTH.143 v46.33,51.82
  Route15 0.203: v54.36,43.33 54.36,44.19 arc45 54.17,44.64 50.73,48.07 arc45 50.28,48.26 48.52,48.26 arc-45 48.07,48.45 46.51,50.01 arc-45 46.33,50.46 v46.33,51.82
  Bottom 0.203: X-EAST.1 v54.36,43.33
N_SDA  (via drill 0.2)
  Top 0.203: X-NORTH.141 v45.83,52.58
  Route15 0.203: v52.45,42.83 52.45,45.46 arc45 52.27,45.91 50.48,47.69 arc45 50.03,47.88 48.27,47.88 arc-45 47.82,48.06 46.01,49.87 arc-45 45.83,50.32 v45.83,52.58
  Bottom 0.203: X-EAST.3 v52.45,42.83
N_SDI  (via drill 0.2)
  Top 0.203: X-NORTH.140 45.33,46.48 arc90 45.96,45.85 47.36,45.85 arc-45 47.81,45.66 48.45,45.02 arc-45 48.64,44.57 48.64,42.96 arc-90 48.01,42.33 v47.24,42.33
  Bottom 0.203: X-EAST.6 v47.24,42.33
N_SDO  (via drill 0.2)
  Top 0.203: X-NORTH.142 45.83,46.74 arc90 46.21,46.36 47.62,46.36 arc-45 48.06,46.17 48.96,45.27 arc-45 49.15,44.82 v49.15,42.83
  Bottom 0.203: X-EAST.4 v49.15,42.83
N_SPI_EN  (via drill 0.2 pad 0.25)
  Top 0.203: X-NORTH.136 44.33,48.69 arc-90 44.71,49.08 46.29,49.08 arc-45 46.74,48.89 49.47,46.16 arc-45 49.66,45.71 49.66,43.85 arc45 49.77,43.58 49.8,43.55 arc-45 49.91,43.28 49.91,42.85 arc-45 49.72,42.4 v49.15,41.83
  Bottom 0.203: X-EAST.8 v49.15,41.83
N_SPI_V  (via drill 0.2)
  Top 0.203: X-NORTH.134 arc-45 43.81,47.77 43.81,49.05 arc-45 44,49.5 v44.08,49.58
  Bottom 0.254: 49.66,41.33 49.41,41.33 X-EAST.10
  Bottom 0.457: 49.66,41.33 arc90 50.16,41.83 50.16,43.42 arc45 49.98,43.87 48.45,45.41 arc-45 48.26,45.86 48.26,47.74 arc45 48.07,48.19 46.88,49.39 arc45 46.43,49.58 v44.08,49.58
N_VE  (via drill 0.2)
  Top 0.203: v37.83,55.12 X-NORTH.109 | X-NORTH.115 v39.33,55.12 | X-NORTH.127 v42.33,55.12 | v43.83,55.12 X-NORTH.133
  Bottom 0.152: v47.94,54.61 47.89,54.61 C5.1
  other vias: 47.31,54.61
  pour Route2 (no thermals): 54.86,51.64 54.86,49.15 arc90 55.5,48.51 56.52,48.51 arc90 57.15,49.15 57.15,49.91 arc90 56.52,50.55 55.88,50.55 55.88,54.86 54.86,55.88 37.59,55.88 arc90 37.34,55.63 37.34,55.12 arc90 37.59,54.86 46.74,54.86 arc-90 46.99,54.61 46.99,54.48 arc90 47.24,54.23 48.01,54.23 arc90 48.26,54.48 48.26,54.61 arc-90 48.51,54.86 51.64,54.86 arc174
N_VE_CV  (via drill 0.2)
  Top 0.203: v9.91,42.33 9.58,42.65 arc-45 9.4,43.1 9.4,47.49 arc-45 9.58,47.94 10.36,48.71 arc-45 10.8,48.89 11.44,48.89 arc-90 11.82,48.51 X-NORTH.6
  Bottom 0.203: X-WEST.96 v9.91,42.33
N_VE_OV  (via drill 0.2)
  Top 0.203: X-NORTH.5 v11.82,52.58
  Route2 0.203: v5.02,42.33 6.76,42.33 arc45 7.2,42.51 8.58,43.88 arc45 8.76,44.33 8.76,46.22 arc-45 8.95,46.67 11.64,49.36 arc45 11.82,49.81 v11.82,52.58
  Bottom 0.203: X-WEST.95 v5.02,42.33
N_VE_RS  (via drill 0.2)
  Top 0.152: X-NORTH.121 v40.83,55.12
  Route2 0.152: v9.91,39.33 9.33,39.9 arc-45 9.14,40.35 9.14,42.41 arc-45 9.33,42.86 9.72,43.25 arc45 9.91,43.7 9.91,46.09 arc-45 10.09,46.54 12.51,48.96 arc-45 12.96,49.15 13.45,49.15 arc45 13.9,49.34 14.8,50.23 arc-45 15.25,50.42 27.78,50.42 arc-45 28.05,50.31 28.08,50.28 arc45 28.35,50.16 36.57,50.16 arc45 37.02,50.35 v37.83,51.16
  Route15 0.152: v37.83,51.16 37.83,53.99 arc-90 38.21,54.38 40.44,54.38 arc90 40.83,54.76 v40.83,55.12
  Bottom 0.152: X-WEST.88 v9.91,39.33
N_VE_UV  (via drill 0.2)
  Top 0.203: X-NORTH.11 v13.32,51.82
  Route15 0.203: v13.32,51.82 13.32,51.31 arc-45 13.14,50.86 8.95,46.67 arc45 8.76,46.22 8.76,44.33 arc-45 8.58,43.88 7.68,42.98 arc45 7.49,42.54 7.49,40.78 arc-45 7.31,40.33 5.99,39.01 arc-45 5.54,38.83 v5.46,38.83
  Bottom 0.203: X-WEST.85 v5.46,38.83
N_VN  (via drill 0.2)
  Top 0.203: X-NORTH.49 v22.82,55.12 | v24.32,55.12 X-NORTH.55 | X-NORTH.61 v25.82,55.12 | v27.32,55.12 X-NORTH.67 | v30.32,55.12 X-NORTH.79 | X-NORTH.85 v31.82,55.12 | v33.33,55.12 X-NORTH.91 | X-NORTH.97 v34.83,55.12
  Bottom 0.152: v49.85,54.61 49.8,54.61 C3.1
  other vias: 49.21,54.61
  pour Route15 (no thermals): 52.32,50.68 arc-87 50.64,54.23 49.02,54.23 arc-90 48.77,54.48 48.77,54.61 arc90 48.51,54.86 22.42,54.86 arc-90 22.16,55.12 22.16,55.63 arc-90 22.42,55.88 54.86,55.88 55.88,54.86 55.88,52.03 arc-40 54.36,50.68 54.36,49.15 arc-90 53.72,48.51 52.96,48.51 arc-90 52.32,49.15
N_VN_CV  (via drill 0.2)
  Top 0.203: X-NORTH.4 11.32,46.56 arc-45 11.14,46.11 v10.54,45.52
  Bottom 0.203: X-WEST.98 9.52,42.83 arc90 9.91,43.21 9.91,44.72 arc-45 10.02,44.99 v10.54,45.52
N_VN_OV  (via drill 0.2)
  Top 0.203: X-NORTH.3 v11.32,51.82
  Route2 0.203: v11.32,51.82 11.32,49.94 arc-45 11.14,49.49 8.44,46.8 arc45 8.25,46.35 8.25,44.46 arc-45 8.07,44.01 7.07,43.01 arc-45 6.62,42.83 v5.46,42.83
  Bottom 0.203: X-WEST.97 v5.46,42.83
N_VN_RS  (via drill 0.2)
  Top 0.152: X-NORTH.73 v28.82,55.12
  Route2 0.152: v8,38.83 8.58,39.4 arc45 8.76,39.85 8.76,42.54 arc-45 8.95,42.98 9.34,43.38 arc45 9.52,43.82 9.52,46.22 arc-45 9.71,46.67 12.39,49.34 arc-45 12.84,49.53 13.33,49.53 arc45 13.77,49.72 14.67,50.61 arc-45 15.12,50.8 27.68,50.8 arc45 28.13,50.99 v28.57,51.44
  Route15 0.152: v28.57,51.44 28.68,51.54 arc45 28.82,51.89 v28.82,55.12
  Bottom 0.152: X-WEST.86 v8,38.83
N_VN_UV  (via drill 0.2)
  Top 0.203: X-NORTH.9 v12.82,52.58
  Route15 0.203: v12.82,52.58 12.82,51.44 arc-45 12.64,50.99 8.44,46.8 arc45 8.25,46.35 8.25,44.46 arc-45 8.07,44.01 7.17,43.11 arc45 6.98,42.66 6.98,40.9 arc-45 6.8,40.45 5.86,39.51 arc-45 5.41,39.33 v5.02,39.33
  Bottom 0.203: X-WEST.87 v5.02,39.33
N_VW  (via drill 0.2)
  Top 0.203: X-NORTH.13 v13.82,55.12 | v15.32,55.12 X-NORTH.19 | v18.32,55.12 X-NORTH.31 | X-NORTH.37 v19.82,55.12
  Bottom 0.152: v9.84,54.61 9.79,54.61 C4.1
  other vias: 9.21,54.61
  pour Route2 (no thermals): 1.27,54.86 2.29,55.88 20.07,55.88 arc-90 20.32,55.63 20.32,55.12 arc-90 20.07,54.86 10.41,54.86 arc90 10.16,54.61 10.16,54.48 arc-90 9.91,54.23 9.14,54.23 arc-90 8.89,54.48 8.89,54.61 arc90 8.64,54.86 5.51,54.86 arc-106 4.83,51.3 4.83,49.15 arc-90 4.19,48.51 3.43,48.51 arc-90 2.79,49.15 2.79,50.16 arc90 2.16,50.8 1.9,50.8 arc-90 1.27,51.44
N_VW_CV  (via drill 0.2)
  Top 0.203: X-NORTH.2 v10.82,46.51
  Bottom 0.203: X-WEST.100 9.4,43.33 9.4,44.82 arc-45 9.58,45.27 v10.82,46.51
N_VW_OV  (via drill 0.2)
  Top 0.203: X-NORTH.1 v10.82,52.58
  Route2 0.203: v10.82,52.58 10.82,50.08 arc-45 10.64,49.63 7.93,46.92 arc45 7.75,46.47 7.75,44.59 arc-45 7.56,44.14 6.93,43.51 arc-45 6.49,43.33 v5.02,43.33
  Bottom 0.203: X-WEST.99 v5.02,43.33
N_VW_RS  (via drill 0.2)
  Top 0.152: X-NORTH.25 v16.82,55.12
  Route15 0.152: v9.91,38.33 8.95,39.28 arc-45 8.76,39.73 8.76,42.54 arc-45 8.95,42.98 9.34,43.38 arc45 9.52,43.82 9.52,46.22 arc-45 9.71,46.67 12.39,49.34 arc-45 12.84,49.53 13.33,49.53 arc45 13.77,49.72 14.67,50.61 arc-45 15.12,50.8 15.61,50.8 arc45 16.06,50.99 16.64,51.56 arc45 16.82,52.01 v16.82,55.12
  Bottom 0.152: X-WEST.84 v9.91,38.33
N_VW_UV  (via drill 0.2)
  Top 0.203: X-NORTH.7 v12.32,51.82
  Route15 0.203: v12.32,51.82 12.32,51.58 arc-45 12.14,51.13 7.93,46.92 arc45 7.75,46.47 7.75,44.59 arc-45 7.56,44.14 6.66,43.24 arc45 6.48,42.79 6.48,41.03 arc-45 6.29,40.58 5.54,39.83 v5.46,39.83
  Bottom 0.203: X-WEST.89 v5.46,39.83
OUT1_N  (via drill 0.2)
  Top 0.152: v16.82,4.95 X-SOUTH.119
  Bottom 0.152: v16.82,4.95 16.82,5.11 16.89,5.17 arc45 16.93,5.26 16.93,9.28 arc45 16.74,9.73 12.75,13.73 arc-45 12.56,14.17 12.56,19.36 arc45 12.37,19.81 10.94,21.25 arc45 10.49,21.43 9.93,21.43 arc45 9.75,21.36 arc-45 9.66,21.32 X-WEST.28
OUT1_P  (via drill 0.2)
  Top 0.152: v17.32,4.57 X-SOUTH.117
  Bottom 0.152: v17.32,4.57 17.32,5.04 arc45 17.29,5.12 17.24,5.17 arc-45 17.21,5.26 17.21,9.4 arc45 17.02,9.85 13.03,13.84 arc-45 12.84,14.29 12.84,19.48 arc45 12.65,19.93 11.05,21.53 arc45 10.61,21.71 9.93,21.71 arc-45 9.75,21.79 arc45 9.66,21.82 X-WEST.30
OUT3_N  (via drill 0.2)
  Top 0.152: X-SOUTH.124 15.82,10.41 arc-45 15.86,10.5 arc45 15.93,10.68 15.93,10.79 arc-45 16.12,11.24 16.18,11.3 arc45 16.37,11.75 16.37,15.55 arc45 16.18,16 10.94,21.25 arc45 10.49,21.43 8.9,21.43 arc45 8.45,21.25 8.32,21.12 arc-45 7.87,20.93 5.69,20.93 arc45 5.62,20.91 5.57,20.86 arc-45 5.48,20.82 v5.02,20.82
  Bottom 0.152: v5.02,20.82 X-WEST.25
OUT3_P  (via drill 0.2)
  Top 0.152: X-SOUTH.122 16.32,10.41 arc45 16.29,10.5 arc-45 16.21,10.68 arc-45 16.4,11.12 16.46,11.19 arc45 16.65,11.63 16.65,15.67 arc45 16.46,16.12 11.05,21.53 arc45 10.61,21.71 8.78,21.71 arc45 8.33,21.53 8.2,21.4 arc-45 7.75,21.21 5.73,21.21 arc-45 5.62,21.26 5.56,21.32 v5.4,21.32
  Bottom 0.152: v5.4,21.32 X-WEST.27
OUT5_N  (via drill 0.2)
  Top 0.152: v19.82,4.95 X-SOUTH.107
  Bottom 0.152: v19.82,4.95 19.82,5.11 19.89,5.17 arc45 19.93,5.26 19.93,8.19 arc45 19.74,8.64 14.02,14.36 arc-45 13.83,14.81 13.83,21.9 arc45 13.64,22.35 12.25,23.75 arc45 11.8,23.93 9.93,23.93 arc45 9.75,23.86 arc-45 9.66,23.82 X-WEST.34
OUT5_P  (via drill 0.2)
  Top 0.152: v20.32,4.57 X-SOUTH.105
  Bottom 0.152: v20.32,4.57 20.32,5.04 arc45 20.29,5.12 20.24,5.17 arc-45 20.21,5.26 20.21,8.3 arc45 20.02,8.75 14.3,14.48 arc-45 14.11,14.93 14.11,22.02 arc45 13.92,22.47 12.36,24.03 arc45 11.91,24.21 9.93,24.21 arc-45 9.75,24.29 arc45 9.66,24.32 X-WEST.36
OUT7_N  (via drill 0.2)
  Top 0.152: X-SOUTH.106 20.32,10.41 arc-45 20.36,10.5 arc45 20.43,10.68 20.43,13.39 arc45 20.25,13.84 10.33,23.76 arc45 9.88,23.94 5.71,23.94 arc45 5.62,23.91 5.61,23.9 arc-45 5.43,23.82 v5.02,23.82
  Bottom 0.152: v5.02,23.82 X-WEST.33
OUT7_P  (via drill 0.2)
  Top 0.152: X-SOUTH.104 20.82,10.41 arc45 20.79,10.5 arc-45 20.71,10.68 20.71,13.51 arc45 20.53,13.96 10.45,24.04 arc45 10,24.22 5.71,24.22 arc-45 5.62,24.26 5.56,24.32 v5.4,24.32
  Bottom 0.152: v5.4,24.32 X-WEST.35
OUT9_N  (via drill 0.2)
  Top 0.152: v22.82,4.95 X-SOUTH.95
  Bottom 0.152: v22.82,4.95 22.82,5.11 22.89,5.17 arc45 22.93,5.26 22.93,7.09 arc45 22.74,7.54 15.29,15 arc-45 15.1,15.44 15.1,22.54 arc45 14.91,22.99 12.65,25.25 arc45 12.2,25.43 9.93,25.43 arc45 9.75,25.36 arc-45 9.66,25.32 X-WEST.40
OUT9_P  (via drill 0.2)
  Top 0.152: v23.32,4.57 X-SOUTH.93
  Bottom 0.152: v23.32,4.57 23.32,5.04 arc45 23.29,5.12 23.24,5.17 arc-45 23.21,5.26 23.21,7.21 arc45 23.02,7.66 15.57,15.11 arc-45 15.38,15.56 15.38,22.66 arc45 15.19,23.1 12.77,25.53 arc45 12.32,25.71 9.93,25.71 arc-45 9.75,25.79 arc45 9.66,25.82 X-WEST.42
OUT11_N  (via drill 0.2)
  Top 0.152: X-SOUTH.100 21.82,10.41 arc-45 21.86,10.5 arc45 21.93,10.68 21.93,13.8 arc45 21.75,14.25 10.74,25.26 arc45 10.29,25.44 5.71,25.44 arc45 5.62,25.41 5.61,25.4 arc-45 5.43,25.32 v5.02,25.32
  Bottom 0.152: v5.02,25.32 X-WEST.39
OUT11_P  (via drill 0.2)
  Top 0.152: X-SOUTH.98 22.32,10.41 arc45 22.29,10.5 arc-45 22.21,10.68 22.21,13.91 arc45 22.03,14.36 10.86,25.54 arc45 10.41,25.72 5.71,25.72 arc-45 5.62,25.76 5.56,25.82 v5.4,25.82
  Bottom 0.152: v5.4,25.82 X-WEST.41
OUT13_N  (via drill 0.2)
  Top 0.152: v25.82,4.95 X-SOUTH.83
  Bottom 0.152: v25.82,4.95 25.82,5.11 25.89,5.17 arc45 25.93,5.26 25.93,6 arc45 25.74,6.45 16.56,15.63 arc-45 16.37,16.08 16.37,23.17 arc45 16.18,23.62 13.06,26.75 arc45 12.61,26.93 9.93,26.93 arc45 9.75,26.86 arc-45 9.66,26.82 X-WEST.46
OUT13_P  (via drill 0.2)
  Top 0.152: v26.32,4.57 X-SOUTH.81
  Bottom 0.152: v26.32,4.57 26.32,5.04 arc45 26.29,5.12 26.24,5.17 arc-45 26.21,5.26 26.21,6.11 arc45 26.02,6.56 16.84,15.75 arc-45 16.65,16.2 16.65,23.29 arc45 16.46,23.74 13.17,27.03 arc45 12.72,27.21 9.93,27.21 arc-45 9.75,27.29 arc45 9.66,27.32 X-WEST.48
OUT15_N  (via drill 0.2)
  Top 0.152: X-SOUTH.82 26.32,10.41 arc-45 26.36,10.5 arc45 26.43,10.68 26.43,11.77 arc-45 26.62,12.21 v32.33,17.92
  Bottom 0.152: X-EAST.54 47.48,27.32 47.38,27.21 45.7,27.21 arc45 45.25,27.03 36.32,18.11 arc-45 35.87,17.92 v32.33,17.92
OUT15_P  (via drill 0.2)
  Top 0.152: X-SOUTH.80 26.82,10.41 arc45 26.79,10.5 arc-45 26.71,10.68 26.71,11.65 arc-45 26.9,12.1 31.93,17.13 arc-45 32.38,17.31 v32.49,17.31
  Bottom 0.152: X-EAST.56 47.48,26.82 47.38,26.93 45.81,26.93 arc45 45.36,26.75 36.44,17.83 arc-45 35.99,17.64 33.08,17.64 arc45 32.63,17.45 v32.49,17.31
OUT17_N  (via drill 0.2)
  Top 0.152: X-SOUTH.76 27.82,10.41 arc-45 27.86,10.5 arc45 27.93,10.68 27.93,11.36 arc-45 28.12,11.81 32.14,15.83 arc-45 32.59,16.02 35.87,16.02 arc45 36.32,16.2 47.14,27.02 arc-45 47.59,27.21 51.43,27.21 arc45 51.54,27.25 arc-45 51.72,27.32 v52.13,27.32
  Bottom 0.152: v52.13,27.32 X-EAST.53
OUT17_P  (via drill 0.2)
  Top 0.152: X-SOUTH.74 28.32,10.41 arc45 28.29,10.5 arc-45 28.21,10.68 28.21,11.31 arc-45 28.35,11.64 32.26,15.55 arc-45 32.71,15.73 35.99,15.73 arc45 36.44,15.92 47.26,26.74 arc-45 47.71,26.93 51.44,26.93 arc-45 51.53,26.89 51.59,26.82 v51.75,26.82
  Bottom 0.152: v51.75,26.82 X-EAST.55
OUT19_N  (via drill 0.2)
  Top 0.152: v30.32,4.95 X-SOUTH.65
  Bottom 0.152: v30.32,4.95 30.32,5.11 30.39,5.17 arc45 30.43,5.26 30.43,10.04 arc-45 30.61,10.49 45.65,25.53 arc-45 46.1,25.71 47.22,25.71 arc45 47.4,25.79 arc-45 47.49,25.82 X-EAST.60
OUT19_P  (via drill 0.2)
  Top 0.152: v30.82,4.57 X-SOUTH.63
  Bottom 0.152: v30.82,4.57 30.82,5.04 arc45 30.79,5.12 30.74,5.17 arc-45 30.71,5.26 30.71,9.93 arc-45 30.89,10.37 45.77,25.25 arc-45 46.22,25.43 47.22,25.43 arc-45 47.4,25.36 arc45 47.49,25.32 X-EAST.62
OUT21_N  (via drill 0.2)
  Top 0.152: X-SOUTH.64 30.82,10.41 arc-45 30.86,10.5 30.9,10.54 arc45 30.93,10.63 30.93,12.45 arc-45 31.12,12.9 32.78,14.56 arc-45 33.23,14.74 36.51,14.74 arc45 36.96,14.93 47.55,25.52 arc-45 48,25.71 51.43,25.71 arc45 51.54,25.75 arc-45 51.72,25.82 v52.13,25.82
  Bottom 0.152: v52.13,25.82 X-EAST.59
OUT21_P  (via drill 0.2)
  Top 0.152: X-SOUTH.62 31.32,10.41 arc45 31.29,10.5 31.25,10.54 arc-45 31.21,10.63 31.21,12.34 arc-45 31.4,12.79 32.89,14.28 arc-45 33.34,14.46 36.62,14.46 arc45 37.07,14.65 47.66,25.24 arc-45 48.11,25.43 51.44,25.43 arc-45 51.53,25.39 51.59,25.32 v51.75,25.32
  Bottom 0.152: v51.75,25.32 X-EAST.61
OUT23_N  (via drill 0.2)
  Top 0.152: v33.33,4.95 X-SOUTH.53
  Bottom 0.152: v33.33,4.95 33.33,5.11 33.39,5.17 arc45 33.43,5.26 33.43,11.14 arc-45 33.61,11.59 46.06,24.03 arc-45 46.5,24.21 47.22,24.21 arc45 47.4,24.29 arc-45 47.49,24.32 X-EAST.66
OUT23_P  (via drill 0.2)
  Top 0.152: v33.83,4.57 X-SOUTH.51
  Bottom 0.152: v33.83,4.57 33.83,5.04 arc45 33.79,5.12 33.74,5.17 arc-45 33.71,5.26 33.71,11.02 arc-45 33.89,11.47 46.17,23.75 arc-45 46.62,23.93 47.22,23.93 arc-45 47.4,23.86 arc45 47.49,23.82 X-EAST.68
OUT25_N  (via drill 0.2)
  Top 0.152: X-SOUTH.58 32.33,10.41 arc-45 32.36,10.5 arc45 32.44,10.68 32.44,12.05 arc-45 32.62,12.5 33.41,13.29 arc-45 33.86,13.47 37.14,13.47 arc45 37.59,13.66 47.95,24.02 arc-45 48.4,24.21 51.43,24.21 arc45 51.54,24.25 arc-45 51.72,24.32 v52.13,24.32
  Bottom 0.152: v52.13,24.32 X-EAST.65
OUT25_P  (via drill 0.2)
  Top 0.152: X-SOUTH.56 32.83,10.41 arc45 32.79,10.5 arc-45 32.71,10.68 32.71,11.93 arc-45 32.9,12.38 33.53,13.01 arc-45 33.98,13.19 37.26,13.19 arc45 37.71,13.38 48.07,23.74 arc-45 48.52,23.93 51.44,23.93 arc-45 51.53,23.89 51.59,23.82 v51.75,23.82
  Bottom 0.152: v51.75,23.82 X-EAST.67
OUT27_N  (via drill 0.2)
  Top 0.152: X-SOUTH.40 36.83,10.41 arc-45 36.86,10.5 arc45 36.94,10.68 36.94,10.84 arc-45 37.12,11.28 46.87,21.03 arc-45 47.31,21.21 51.45,21.21 arc45 51.54,21.25 arc-45 51.72,21.32 v52.13,21.32
  Bottom 0.152: v52.13,21.32 X-EAST.73
OUT27_P  (via drill 0.2)
  Top 0.152: X-SOUTH.38 37.33,10.41 arc45 37.29,10.5 arc-45 37.22,10.68 37.22,10.72 arc-45 37.4,11.17 46.98,20.75 arc-45 47.43,20.93 51.42,20.93 arc-45 51.53,20.89 51.59,20.82 v51.75,20.82
  Bottom 0.152: v51.75,20.82 X-EAST.75
OUT29_N  (via drill 0.2)
  Top 0.152: v36.33,4.95 X-SOUTH.41
  Bottom 0.152: v36.33,4.95 36.33,5.11 36.39,5.17 arc45 36.43,5.26 36.43,12.23 arc-45 36.61,12.68 45.46,21.53 arc-45 45.91,21.71 47.22,21.71 arc45 47.4,21.79 arc-45 47.49,21.82 X-EAST.72
OUT29_P  (via drill 0.2)
  Top 0.152: v36.83,4.57 X-SOUTH.39
  Bottom 0.152: v36.83,4.57 36.83,5.04 arc45 36.79,5.12 36.74,5.17 arc-45 36.71,5.26 36.71,12.11 arc-45 36.89,12.56 45.58,21.25 arc-45 46.03,21.43 47.22,21.43 arc-45 47.4,21.36 arc45 47.49,21.32 X-EAST.74
OUT31_N  (via drill 0.2)
  Top 0.152: v37.83,4.95 X-SOUTH.35
  Bottom 0.152: v37.83,4.95 37.83,5.11 37.89,5.17 arc45 37.93,5.26 37.93,11.83 arc-45 38.11,12.27 45.87,20.03 arc-45 46.31,20.21 47.22,20.21 arc45 47.4,20.29 arc-45 47.49,20.32 X-EAST.78
OUT31_P  (via drill 0.2)
  Top 0.152: v38.33,4.57 X-SOUTH.33
  Bottom 0.152: v38.33,4.57 38.33,5.04 arc45 38.29,5.12 38.24,5.17 arc-45 38.21,5.26 38.21,11.71 arc-45 38.39,12.16 45.98,19.75 arc-45 46.43,19.93 47.22,19.93 arc-45 47.4,19.86 arc45 47.49,19.82 X-EAST.80
OUT33_N  (via drill 0.2)
  Top 0.152: X-NORTH.20 15.32,46.74 arc45 15.36,46.65 arc-45 15.43,46.47 15.43,44.47 arc-45 15.25,44.02 12.75,41.52 arc45 12.56,41.07 12.56,35.88 arc-45 12.37,35.43 10.35,33.41 arc-45 9.9,33.22 5.71,33.22 arc-45 5.62,33.26 5.56,33.33 v5.4,33.33
  Bottom 0.152: v5.4,33.33 X-WEST.67
OUT33_P  (via drill 0.2)
  Top 0.152: X-NORTH.22 15.82,46.74 arc-45 15.79,46.65 arc45 15.71,46.47 15.71,44.35 arc-45 15.53,43.91 13.03,41.4 arc45 12.84,40.95 12.84,35.77 arc-45 12.65,35.32 10.47,33.13 arc-45 10.02,32.94 5.71,32.94 arc45 5.62,32.91 5.61,32.9 arc-45 5.43,32.83 v5.02,32.83
  Bottom 0.152: v5.02,32.83 X-WEST.65
OUT35_N  (via drill 0.2)
  Top 0.152: X-NORTH.26 16.82,46.74 arc45 16.86,46.65 arc-45 16.93,46.47 16.93,44.07 arc-45 16.75,43.62 14.02,40.88 arc45 13.83,40.44 13.83,35.25 arc-45 13.64,34.8 10.76,31.91 arc-45 10.31,31.72 5.71,31.72 arc-45 5.62,31.76 5.56,31.82 v5.4,31.82
  Bottom 0.152: v5.4,31.82 X-WEST.61
OUT35_P  (via drill 0.2)
  Top 0.152: X-NORTH.28 17.32,46.74 arc-45 17.29,46.65 arc45 17.21,46.47 17.21,43.95 arc-45 17.03,43.5 14.3,40.77 arc45 14.11,40.32 14.11,35.13 arc-45 13.92,34.68 10.87,31.63 arc-45 10.42,31.44 5.71,31.44 arc45 5.62,31.41 5.61,31.4 arc-45 5.43,31.32 v5.02,31.32
  Bottom 0.152: v5.02,31.32 X-WEST.59
OUT37_N  (via drill 0.2)
  Top 0.152: X-NORTH.32 18.32,46.74 arc45 18.36,46.65 arc-45 18.43,46.47 18.43,43.66 arc-45 18.25,43.21 15.29,40.25 arc45 15.1,39.8 15.1,34.61 arc-45 14.91,34.16 8.16,27.41 arc-45 7.71,27.22 5.71,27.22 arc-45 5.62,27.26 5.56,27.32 v5.4,27.32
  Bottom 0.152: v5.4,27.32 X-WEST.47
OUT37_P  (via drill 0.2)
  Top 0.152: X-NORTH.34 18.82,46.74 arc-45 18.79,46.65 arc45 18.71,46.47 18.71,43.55 arc-45 18.53,43.1 15.57,40.13 arc45 15.38,39.68 15.38,34.49 arc-45 15.19,34.05 8.28,27.13 arc-45 7.83,26.94 5.71,26.94 arc45 5.62,26.91 5.61,26.9 arc-45 5.43,26.82 v5.02,26.82
  Bottom 0.152: v5.02,26.82 X-WEST.45
OUT39_N  (via drill 0.2)
  Top 0.152: v20.32,52.58 X-NORTH.39
  Bottom 0.152: v20.32,52.58 20.32,52.11 arc45 20.36,52.02 20.41,51.98 arc-45 20.44,51.89 20.44,51.38 arc-45 20.26,50.94 11.48,42.15 arc45 11.29,41.7 11.29,38.42 arc-45 11.1,37.97 10.53,37.4 arc-45 10.08,37.22 9.93,37.22 arc-45 9.75,37.29 arc45 9.66,37.33 X-WEST.80
OUT39_P  (via drill 0.2)
  Top 0.152: v20.82,52.2 X-NORTH.41
  Bottom 0.152: v20.82,52.2 20.82,52.04 20.76,51.98 arc45 20.72,51.89 20.72,51.27 arc-45 20.54,50.82 11.76,42.04 arc45 11.57,41.59 11.57,38.3 arc-45 11.38,37.86 10.65,37.12 arc-45 10.2,36.94 9.93,36.94 arc45 9.75,36.86 arc-45 9.66,36.83 X-WEST.78
OUT41_N  (via drill 0.2)
  Top 0.152: v21.82,52.58 X-NORTH.45
  Bottom 0.152: v21.82,52.58 21.82,52.11 arc45 21.86,52.02 21.91,51.98 arc-45 21.94,51.89 21.94,50.98 arc-45 21.76,50.53 12.75,41.52 arc45 12.56,41.07 12.56,37.79 arc-45 12.37,37.34 10.94,35.9 arc-45 10.49,35.71 9.93,35.71 arc-45 9.75,35.79 arc45 9.66,35.83 X-WEST.74
OUT41_P  (via drill 0.2)
  Top 0.152: v22.32,52.2 X-NORTH.47
  Bottom 0.152: v22.32,52.2 22.32,52.04 22.26,51.98 arc45 22.22,51.89 22.22,50.86 arc-45 22.04,50.41 13.03,41.4 arc45 12.84,40.95 12.84,37.67 arc-45 12.65,37.22 11.05,35.62 arc-45 10.61,35.44 9.93,35.44 arc45 9.75,35.36 arc-45 9.66,35.33 X-WEST.72
OUT43_N  (via drill 0.2)
  Top 0.152: v23.32,52.58 X-NORTH.51
  Bottom 0.152: v23.32,52.58 23.32,52.11 arc45 23.36,52.02 23.41,51.98 arc-45 23.44,51.89 23.44,50.58 arc-45 23.26,50.13 14.02,40.88 arc45 13.83,40.44 13.83,35.25 arc-45 13.64,34.8 12.25,33.4 arc-45 11.8,33.21 9.93,33.21 arc-45 9.75,33.29 arc45 9.66,33.33 X-WEST.68
OUT43_P  (via drill 0.2)
  Top 0.152: v23.82,52.2 X-NORTH.53
  Bottom 0.152: v23.82,52.2 23.82,52.04 23.76,51.98 arc45 23.72,51.89 23.72,50.46 arc-45 23.54,50.01 14.3,40.77 arc45 14.11,40.32 14.11,35.13 arc-45 13.92,34.68 12.36,33.12 arc-45 11.91,32.94 9.93,32.94 arc45 9.75,32.86 arc-45 9.66,32.83 X-WEST.66
OUT45_N  (via drill 0.2)
  Top 0.152: v24.82,52.58 X-NORTH.57
  Bottom 0.152: v24.82,52.58 24.82,52.11 arc45 24.86,52.02 24.91,51.98 arc-45 24.94,51.89 24.94,50.17 arc-45 24.76,49.72 15.29,40.25 arc45 15.1,39.8 15.1,34.61 arc-45 14.91,34.16 12.65,31.9 arc-45 12.2,31.71 9.93,31.71 arc-45 9.75,31.79 arc45 9.66,31.82 X-WEST.62
OUT45_P  (via drill 0.2)
  Top 0.152: v25.32,52.2 X-NORTH.59
  Bottom 0.152: v25.32,52.2 25.32,52.04 25.26,51.98 arc45 25.22,51.89 25.22,50.05 arc-45 25.04,49.61 15.57,40.13 arc45 15.38,39.68 15.38,34.49 arc-45 15.19,34.05 12.77,31.62 arc-45 12.32,31.43 9.93,31.43 arc45 9.75,31.36 arc-45 9.66,31.32 X-WEST.60
OUT47_N  (via drill 0.2)
  Top 0.152: v26.32,52.58 X-NORTH.63
  Bottom 0.152: v26.32,52.58 26.32,52.11 arc45 26.36,52.02 26.41,51.98 arc-45 26.44,51.89 26.44,49.77 arc-45 26.26,49.32 16.56,39.61 arc45 16.37,39.16 16.37,33.98 arc-45 16.18,33.53 13.06,30.4 arc-45 12.61,30.21 9.93,30.21 arc-45 9.75,30.29 arc45 9.66,30.32 X-WEST.56
OUT47_P  (via drill 0.2)
  Top 0.152: v26.82,52.2 X-NORTH.65
  Bottom 0.152: v26.82,52.2 26.82,52.04 26.76,51.98 arc45 26.72,51.89 26.72,49.65 arc-45 26.54,49.2 16.84,39.5 arc45 16.65,39.05 16.65,33.86 arc-45 16.46,33.41 13.17,30.12 arc-45 12.72,29.93 9.93,29.93 arc45 9.75,29.86 arc-45 9.66,29.82 X-WEST.54
OUT49_N  (via drill 0.2)
  Top 0.152: v28.82,46.48 X-NORTH.74
  Bottom 0.152: X-EAST.48 47.49,29.82 arc-45 47.4,29.86 arc45 47.22,29.93 45.7,29.93 arc-45 45.25,30.12 33.15,42.22 arc45 32.7,42.41 31.32,42.41 arc-45 30.87,42.59 29.12,44.34 arc-45 28.93,44.79 28.93,45.82 arc45 28.9,45.91 28.86,45.95 arc-45 28.82,46.04 v28.82,46.48
OUT49_P  (via drill 0.2)
  Top 0.152: v29.32,46.1 X-NORTH.76
  Bottom 0.152: X-EAST.46 47.49,30.32 arc45 47.4,30.29 arc-45 47.22,30.21 45.81,30.21 arc-45 45.36,30.4 33.26,42.5 arc45 32.81,42.69 31.44,42.69 arc-45 30.99,42.87 29.4,44.46 arc-45 29.21,44.91 29.21,45.62 arc-45 29.25,45.71 29.29,45.75 arc45 29.32,45.84 v29.32,46.1
OUT51_N  (via drill 0.2)
  Top 0.152: v30.32,46.48 X-NORTH.80
  Bottom 0.152: X-EAST.42 47.49,31.32 arc-45 47.4,31.36 arc45 47.22,31.43 46.1,31.43 arc-45 45.65,31.62 33.78,43.49 arc45 33.33,43.67 31.95,43.67 arc-45 31.51,43.86 30.62,44.75 arc-45 30.43,45.2 30.43,45.82 arc45 30.4,45.91 30.36,45.95 arc-45 30.32,46.04 v30.32,46.48
OUT51_P  (via drill 0.2)
  Top 0.152: v30.82,46.1 X-NORTH.82
  Bottom 0.152: X-EAST.40 47.49,31.82 arc45 47.4,31.79 arc-45 47.22,31.71 46.22,31.71 arc-45 45.77,31.9 33.9,43.77 arc45 33.45,43.95 32.07,43.95 arc-45 31.62,44.14 30.9,44.86 arc-45 30.71,45.31 30.71,45.62 arc-45 30.75,45.71 30.79,45.75 arc45 30.82,45.84 v30.82,46.1
OUT53_N  (via drill 0.2)
  Top 0.152: X-NORTH.86 31.82,46.74 arc45 31.86,46.65 arc-45 31.93,46.47 31.93,43.7 arc45 32.12,43.25 45.25,30.11 arc45 45.7,29.93 51.44,29.93 arc-45 51.53,29.89 51.59,29.82 v51.75,29.82
  Bottom 0.152: v51.75,29.82 X-EAST.47
OUT53_P  (via drill 0.2)
  Top 0.152: X-NORTH.88 32.33,46.74 arc-45 32.29,46.65 arc45 32.21,46.47 32.21,43.81 arc45 32.4,43.36 45.37,30.39 arc45 45.82,30.21 51.43,30.21 arc45 51.54,30.25 arc-45 51.72,30.32 v52.13,30.32
  Bottom 0.152: v52.13,30.32 X-EAST.45
OUT55_N  (via drill 0.2)
  Top 0.152: X-NORTH.92 33.33,46.74 arc45 33.36,46.65 arc-45 33.44,46.47 33.44,44.1 arc45 33.62,43.65 45.66,31.61 arc45 46.11,31.43 51.44,31.43 arc-45 51.53,31.39 51.59,31.32 v51.75,31.32
  Bottom 0.152: v51.75,31.32 X-EAST.41
OUT55_P  (via drill 0.2)
  Top 0.152: X-NORTH.94 33.83,46.74 arc-45 33.79,46.65 arc45 33.71,46.47 33.71,44.22 arc45 33.9,43.77 45.78,31.89 arc45 46.22,31.71 51.43,31.71 arc45 51.54,31.75 arc-45 51.72,31.82 v52.13,31.82
  Bottom 0.152: v52.13,31.82 X-EAST.39
OUT57_N  (via drill 0.2)
  Top 0.152: X-NORTH.98 34.83,46.74 arc45 34.86,46.65 arc-45 34.94,46.47 34.94,44.5 arc45 35.12,44.06 46.06,33.11 arc45 46.51,32.93 51.44,32.93 arc-45 51.53,32.89 51.59,32.83 v51.75,32.83
  Bottom 0.152: v51.75,32.83 X-EAST.35
OUT57_P  (via drill 0.2)
  Top 0.152: X-NORTH.100 35.33,46.74 arc-45 35.29,46.65 arc45 35.21,46.47 35.21,44.62 arc45 35.4,44.17 46.18,33.39 arc45 46.63,33.21 51.43,33.21 arc45 51.54,33.25 arc-45 51.72,33.33 v52.13,33.33
  Bottom 0.152: v52.13,33.33 X-EAST.33
OUT59_N  (via drill 0.2)
  Top 0.152: X-NORTH.104 36.33,46.74 arc45 36.36,46.65 arc-45 36.44,46.47 36.44,44.91 arc45 36.62,44.46 45.46,35.62 arc45 45.91,35.44 49.87,35.44 arc45 50.32,35.62 50.44,35.74 arc-45 50.89,35.93 51.44,35.93 arc-45 51.53,35.89 51.59,35.83 v51.75,35.83
  Bottom 0.152: v51.75,35.83 X-EAST.27
OUT59_P  (via drill 0.2)
  Top 0.152: X-NORTH.106 36.83,46.74 arc-45 36.79,46.65 arc45 36.72,46.47 36.72,45.03 arc45 36.9,44.58 45.58,35.9 arc45 46.03,35.71 49.75,35.71 arc45 50.2,35.9 50.32,36.02 arc-45 50.77,36.21 51.43,36.21 arc45 51.54,36.25 arc-45 51.72,36.33 v52.13,36.33
  Bottom 0.152: v52.13,36.33 X-EAST.25
OUT61_N  (via drill 0.2)
  Top 0.152: v35.33,52.58 X-NORTH.99